# EAGLE design RMCB4 (EAGLE 9.5.2)
COMPANY: ADAFRUIT INDUSTRIES; DRAWN: KTOWN; REV: B
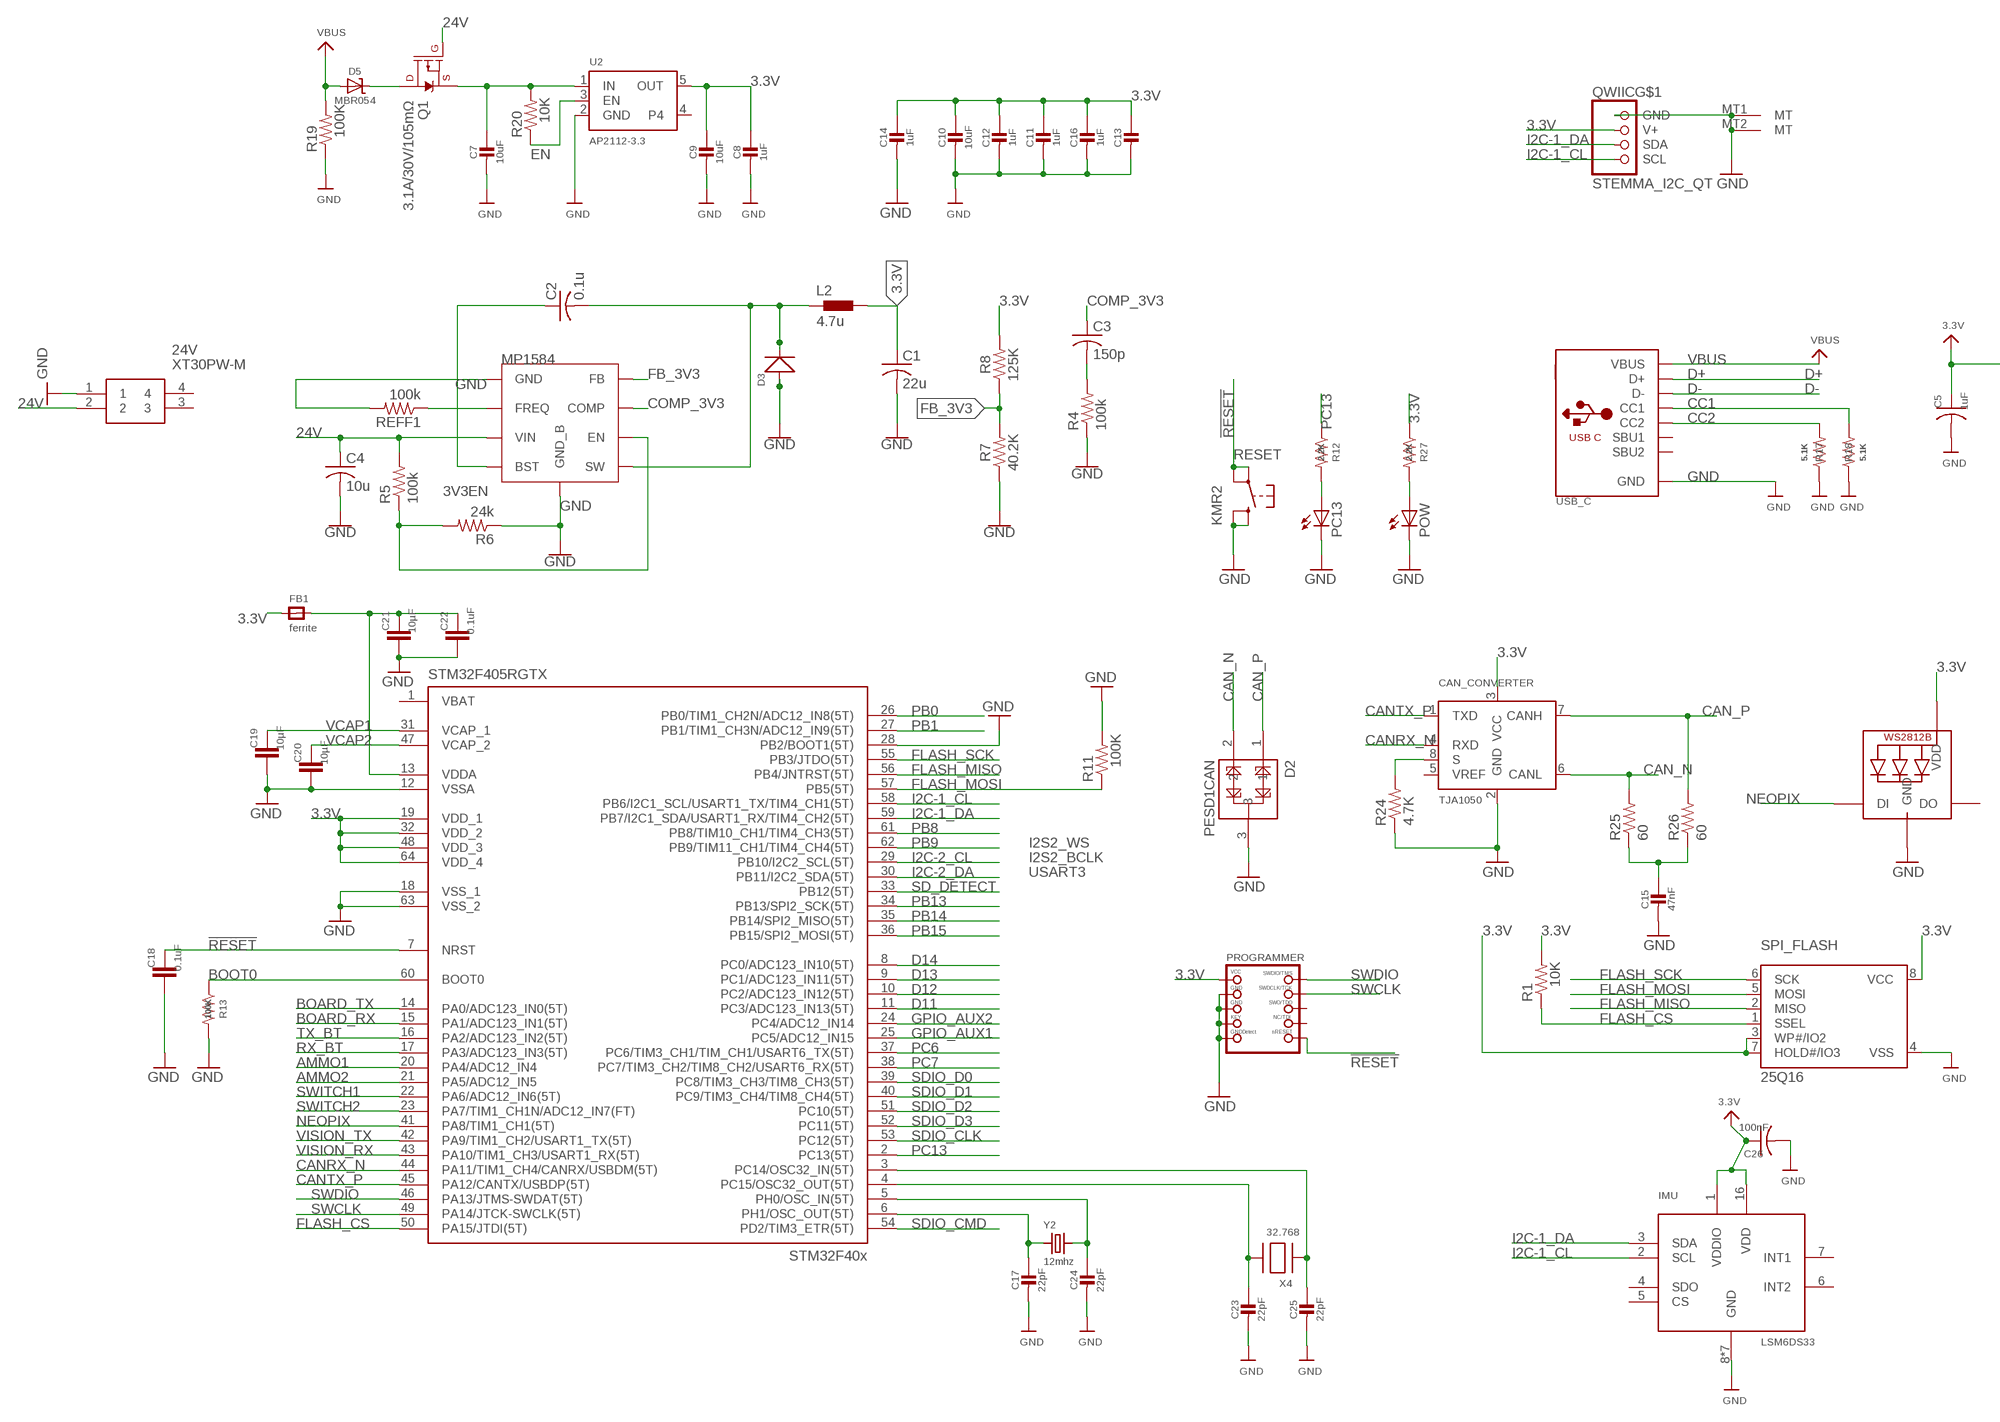
[diagram p0: schematic, sheet 1, part 1 of 2]
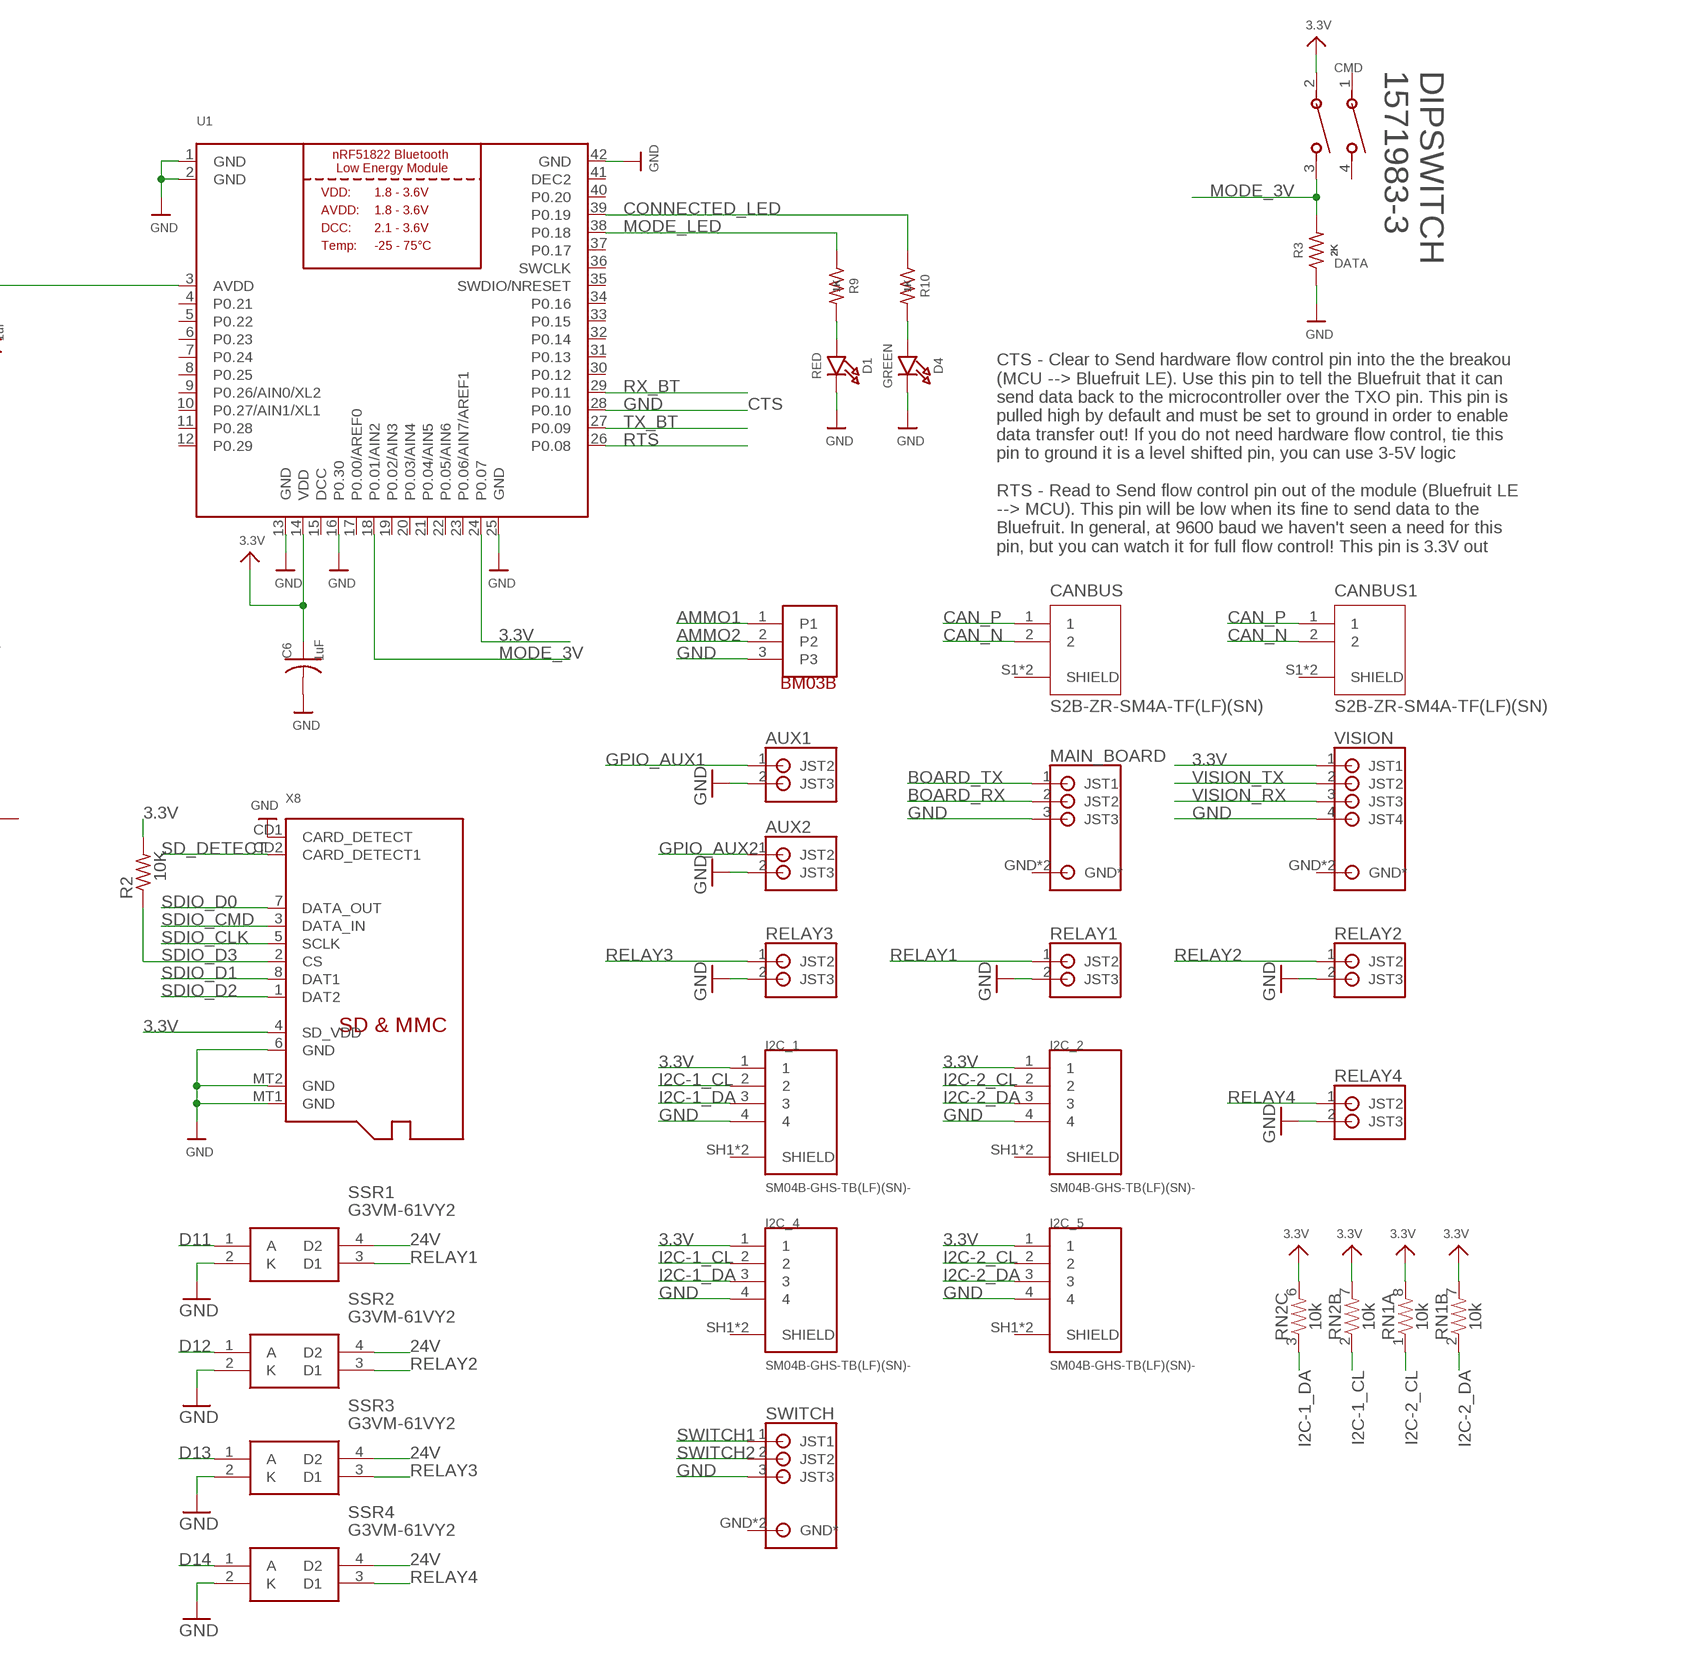
[diagram p1: schematic, sheet 1, part 2 of 2]

## Parts
24V  XT30PW-M  [XT30PWM]
AMMO_DETEC  BM03-GHS_TBT  [BM03-GHS-TBT]
AUX1  S2B-PH-SM4_TB  [S2B-PH-SM4_TB]
AUX2  S2B-PH-SM4_TB  [S2B-PH-SM4_TB]
C1  22u  C-USC1206  [C1206]
C2  0.1u  C-USC0603  [C0603]
C3  150p  C-USC0603  [C0603]
C4  10u  C-USC1206  [C1206]
C5  1uF  C-USC0603  [C0603]
C6  1uF  C-USC0603  [C0603]
C7  10uF  CAP_CERAMIC0603_NO  [0603-NO]
C8  1uF  CAP_CERAMIC0603_NO  [0603-NO]
C9  10uF  CAP_CERAMIC0603_NO  [0603-NO]
C10  10uF  CAP_CERAMIC0603_NO  [0603-NO]
C11  1uF  CAP_CERAMIC0603_NO  [0603-NO]
C12  1uF  CAP_CERAMIC0603_NO  [0603-NO]
C13  1uF  CAP_CERAMIC0603_NO  [0603-NO]
C14  1uF  CAP_CERAMIC0603_NO  [0603-NO]
C15  47nF  CAP_CERAMIC0603_NO  [0603-NO]
C16  1uF  CAP_CERAMIC0603_NO  [0603-NO]
C17  22pF  CAP_CERAMIC0603_NO  [0603-NO]
C18  0.1uF  C-EUC0603  [C0603]
C19  10µF  C-EUC0603  [C0603]
C20  10µF  C-EUC0603  [C0603]
C21  10µF  C-EUC0603  [C0603]
C22  0.1uF  C-EUC0603  [C0603]
C23  22pF  CAP_CERAMIC0603_NO  [0603-NO]
C24  22pF  CAP_CERAMIC0603_NO  [0603-NO]
C25  22pF  CAP_CERAMIC0603_NO  [0603-NO]
C26  100nF  C-USC0603  [C0603]
CAN_CONVERTER  TJA1050  [SOT96-1]
CANBUS  S2B-ZR-SM4A-TF(LF)(SN)  [JST_S2B-ZR-SM4A-TF(LF)(SN)]
CANBUS1  S2B-ZR-SM4A-TF(LF)(SN)  [JST_S2B-ZR-SM4A-TF(LF)(SN)]
D1  RED  LED0805_NOOUTLINE  [CHIPLED_0805_NOOUTLINE]
D2  PESD1CAN  [SOT23-3]
D3  SMD-DIODE-SCHOTTKY-40V-3A(DO-214AB)  [DO-214AB]
D4  GREEN  LED0805_NOOUTLINE  [CHIPLED_0805_NOOUTLINE]
D5  MBR054  DIODE-SCHOTTKYSOD-123  [SOD-123]
DIPSWITCH  1571983-3  [SWSO4_300X100P50B]
FB1  ferrite  FERRITE-0805NO  [0805-NO@1]
I2C_1  SM04B-GHS-TB(LF)(SN)-  [JST_SM04B-GHS-TB(LF)(SN)-]
I2C_2  SM04B-GHS-TB(LF)(SN)-  [JST_SM04B-GHS-TB(LF)(SN)-]
I2C_4  SM04B-GHS-TB(LF)(SN)-  [JST_SM04B-GHS-TB(LF)(SN)-]
I2C_5  SM04B-GHS-TB(LF)(SN)-  [JST_SM04B-GHS-TB(LF)(SN)-]
IMU  LSM6DS33  [LGA16_3X3MM]
L2  4.7u  MHCI0603-4R7M-R8  [MHCI0603-4R7M-R8]
MAIN_BOARD  S3B-PH-SM4_TB  [S3B-PH-SM4_TB]
NEO  WS2812B3535  [LED3535]
PC13  LEDCHIPLED_0603  [CHIPLED_0603]
POW  LEDCHIPLED_0603  [CHIPLED_0603]
PROGRAMMER  JTAG-CORTEX  [2X05_1.27MM_SMT]
Q1  3.1A/30V/105mΩ  MOSFET_PCH-DMG2307L  [SOT23-3]
QWIIC  STEMMA_I2C_QT  [JST_SH4]
R1  10K  R-US_R0603  [R0603]
R2  10K  R-US_R0603  [R0603]
R3  2K  R-US_R0603  [R0603]
R4  100k  R-US_R0603  [R0603]
R5  100k  R-US_R0603  [R0603]
R6  24k  R-US_R0603  [R0603]
R7  40.2K  220KOHM-0603-1/10W-1%  [0603]
R8  125K  RESISTOR0603  [0603]
R9  1K  R-US_R0603  [R0603]
R10  1K  R-US_R0603  [R0603]
R11  100K  R-US_R0603  [R0603]
R12  2.2K  R-US_R0603  [R0603]
R13  100K  R-US_R0603  [R0603]
R17  5.1K  R-US_R0603  [R0603]
R18  5.1K  R-US_R0603  [R0603]
R19  100K  R-US_R0603  [R0603]
R20  10K  R-US_R0603  [R0603]
R24  4.7K  R-US_R0603  [R0603]
R25  60  R-US_R0603  [R0603]
R26  60  R-US_R0603  [R0603]
R27  2.2K  R-US_R0603  [R0603]
REFF1  100k  R-US_R0603  [R0603]
RELAY1  S2B-PH-SM4_TB  [S2B-PH-SM4_TB]
RELAY2  S2B-PH-SM4_TB  [S2B-PH-SM4_TB]
RELAY3  S2B-PH-SM4_TB  [S2B-PH-SM4_TB]
RELAY4  S2B-PH-SM4_TB  [S2B-PH-SM4_TB]
RESET  KMR2  SWITCH_TACT_SMT4.6X2.8  [BTN_KMR2_4.6X2.8]
RN1  10k  1KOHM-ARRAY(4)-0805_ARV-1/10W-5%  [0805-ARV]
RN2  10k  1KOHM-ARRAY(4)-0805_ARV-1/10W-5%  [0805-ARV]
SPI_FLASH  25Q16  SPIFLASH_8PIN  [SOIC8_150MIL]
SSR1  G3VM-61VY2  [SOP254P700X230-4N]
SSR2  G3VM-61VY2  [SOP254P700X230-4N]
SSR3  G3VM-61VY2  [SOP254P700X230-4N]
SSR4  G3VM-61VY2  [SOP254P700X230-4N]
STM32F405RGTX  STM32F405R  [TQFP64]
SWITCH  S3B-PH-SM4_TB  [S3B-PH-SM4_TB]
U1  NRF51822_MODULE_MDBT40  [BLE_MODULE_RAYTAC_MDBT40]
U2  AP2112-3.3  VREG_SOT23-5  [SOT23-5]
U$10  MP1584_V2  [MP1584_V2]
USB_C  USB_C  [USB_C_CUSB31-CFM2AX-01-X]
VISION  S4B-PH-SM4_TB  [S4B-PH-SM4_TB]
X4  32.768  XTAL-3.2X1.5  [XTAL3215]
X8  MICROSD  [MICROSD]
Y2  12mhz  CRYSTAL2.5X2.0  [CRYSTAL_2.5X2]

## Nets
3.3V: C1.1 C5.1 C6.1 C8.1 C9.1 C10.1 C11.1 C12.1 C13.1 C14.1 C16.1 C26.1 CAN_CONVERTER.3(VCC) DIPSWITCH.2 FB1.1 I2C_1.1 I2C_2.1 I2C_4.1 I2C_5.1 IMU.1(VDDIO) IMU.16(VDD) L2.P$2 NEO.2(VDD) PROGRAMMER.1(VCC) QWIIC.2(V+) R1.2 R2.2 R8.2 R27.1 RN1.7 RN1.8 RN2.6 RN2.7 SPI_FLASH.3(WP#/IO2) SPI_FLASH.7(HOLD#/IO3) SPI_FLASH.8(VCC) STM32F405RGTX.19(VDD_1) STM32F405RGTX.32(VDD_2) STM32F405RGTX.48(VDD_3) STM32F405RGTX.64(VDD_4) U1.3(AVDD) U1.14(VDD) U1.24(P0.07) U2.5(OUT) VISION.1(JST1) X8.4(SD_VDD)
3V3EN: R5.1 R6.2 U$10.EN
24V [power]: 24V.2 C4.1 Q1.1(G) R5.2 SSR1.4(D2) SSR2.4(D2) SSR3.4(D2) SSR4.4(D2) U$10.VIN
!RESET: C18.1 PROGRAMMER.10(NRESET) RESET.A'(P1) RESET.A(P) STM32F405RGTX.7(NRST)
AMMO1: AMMO_DETEC.1 STM32F405RGTX.20(PA4/ADC12_IN4)
AMMO2: AMMO_DETEC.2 STM32F405RGTX.21(PA5/ADC12_IN5)
BOARD_RX: MAIN_BOARD.2(JST2) STM32F405RGTX.15(PA1/ADC123_IN1(5T))
BOARD_TX: MAIN_BOARD.1(JST1) STM32F405RGTX.14(PA0/ADC123_IN0(5T))
BOOT0: R13.1 STM32F405RGTX.60(BOOT0)
BST1: C2.1 U$10.BST
CAN_N: CAN_CONVERTER.6(CANL) CANBUS1.2 CANBUS.2 D2.2 R25.2
CAN_P: CAN_CONVERTER.7(CANH) CANBUS1.1 CANBUS.1 D2.1 R26.2
CANRX_N: CAN_CONVERTER.4(RXD) STM32F405RGTX.44(PA11/TIM1_CH4/CANRX/USBDM(5T))
CANTX_P: CAN_CONVERTER.1(TXD) STM32F405RGTX.45(PA12/CANTX/USBDP(5T))
CC1: R18.2 USB_C.A5(CC1)
CC2: R17.2 USB_C.B5(CC2)
COMP_3V3: C3.1 U$10.COMP
CONNECTED_LED: R10.1 U1.39(P0.19)
D11: SSR1.1(A) STM32F405RGTX.11(PC3/ADC123_IN13(5T))
D12: SSR2.1(A) STM32F405RGTX.10(PC2/ADC123_IN12(5T))
D13: SSR3.1(A) STM32F405RGTX.9(PC1/ADC123_IN11(5T))
D14: SSR4.1(A) STM32F405RGTX.8(PC0/ADC123_IN10(5T))
D+: USB_C.A6(D+) USB_C.B6(D+)
D-: USB_C.A7(D-) USB_C.B7(D-)
EN: R20.1 U2.3(EN)
FB_3V3: R7.2 R8.1 U$10.FB
FLASH_CS: R1.1 SPI_FLASH.1(SSEL) STM32F405RGTX.50(PA15/JTDI(5T))
FLASH_MISO: SPI_FLASH.2(MISO) STM32F405RGTX.56(PB4/JNTRST(5T))
FLASH_MOSI: R11.1 SPI_FLASH.5(MOSI) STM32F405RGTX.57(PB5(5T))
FLASH_SCK: SPI_FLASH.6(SCK) STM32F405RGTX.55(PB3/JTDO(5T))
FREQ1: REFF1.1 U$10.FREQ
GND [gnd]: 24V.1 AMMO_DETEC.3 AUX1.2(JST3) AUX2.2(JST3) C1.2 C4.2 C5.2 C6.2 C7.2 C8.2 C9.2 C10.2 C11.2 C12.2 C13.2 C14.2 C15.2 C16.2 C17.2 C18.2 C19.2 C20.2 C21.2 C22.2 C23.2 C24.2 C25.2 C26.2 CAN_CONVERTER.2(GND) D1.C D2.3 D3.1(+) D4.C I2C_1.4 I2C_2.4 I2C_4.4 I2C_5.4 IMU.8(GND) IMU.9(GND) IMU.10(GND) IMU.11(GND) IMU.12(GND) IMU.13(GND) IMU.15(GND) MAIN_BOARD.3(JST3) NEO.4(GND) PC13.C POW.C PROGRAMMER.3(GND) PROGRAMMER.5(GND) PROGRAMMER.7(KEY) PROGRAMMER.9(GNDDETECT) QWIIC.1(GND) QWIIC.MT1(MT) QWIIC.MT2(MT) R3.1 R4.1 R6.1 R7.1 R11.2 R13.2 R17.1 R18.1 R19.1 R24.1 REFF1.2 RELAY1.2(JST3) RELAY2.2(JST3) RELAY3.2(JST3) RELAY4.2(JST3) RESET.B'(S1) RESET.B(S) SPI_FLASH.4(VSS) SSR1.2(K) SSR2.2(K) SSR3.2(K) SSR4.2(K) STM32F405RGTX.12(VSSA) STM32F405RGTX.18(VSS_1) STM32F405RGTX.28(PB2/BOOT1(5T)) STM32F405RGTX.63(VSS_2) SWITCH.3(JST3) U1.1(GND) U1.2(GND) U1.13(GND) U1.16(P0.30) U1.25(GND) U1.28(P0.10) U1.42(GND) U2.2(GND) U$10.GND U$10.GND_B USB_C.A1B12(GND) USB_C.B1A12(GND) VISION.4(JST4) X8.6(GND) X8.CD1(CARD_DETECT) X8.MT1(GND) X8.MT2(GND)
GPIO_AUX1: AUX1.1(JST2) STM32F405RGTX.25(PC5/ADC12_IN15)
GPIO_AUX2: AUX2.1(JST2) STM32F405RGTX.24(PC4/ADC12_IN14)
I2C-1_CL: I2C_1.2 I2C_4.2 IMU.2(SCL) QWIIC.4(SCL) RN2.2 STM32F405RGTX.58(PB6/I2C1_SCL/USART1_TX/TIM4_CH1(5T))
I2C-1_DA: I2C_1.3 I2C_4.3 IMU.3(SDA) QWIIC.3(SDA) RN2.3 STM32F405RGTX.59(PB7/I2C1_SDA/USART1_RX/TIM4_CH2(5T))
I2C-2_CL: I2C_2.2 I2C_5.2 RN1.1 STM32F405RGTX.29(PB10/I2C2_SCL(5T))
I2C-2_DA: I2C_2.3 I2C_5.3 RN1.2 STM32F405RGTX.30(PB11/I2C2_SDA(5T))
MODE_3V: DIPSWITCH.3 R3.2 U1.18(P0.01/AIN2)
MODE_LED: R9.1 U1.38(P0.18)
N$3: C3.2 R4.2
N$5: D1.A R9.2
N$6: D4.A R10.2
N$9: C25.1 STM32F405RGTX.3(PC14/OSC32_IN(5T)) X4.P$1
N$10: C23.1 STM32F405RGTX.4(PC15/OSC32_OUT(5T)) X4.P$2
N$11: C24.1 STM32F405RGTX.5(PH0/OSC_IN(5T)) Y2.3
N$12: C17.1 STM32F405RGTX.6(PH1/OSC_OUT(5T)) Y2.1
N$13: PC13.A R12.2
N$20: C21.1 C22.1 FB1.2 STM32F405RGTX.13(VDDA)
N$21: CAN_CONVERTER.8(S) R24.2
N$22: C15.1 R25.1 R26.1
N$23: POW.A R27.2
N$32: D5.C Q1.3(D)
NEOPIX: NEO.1(DI) STM32F405RGTX.41(PA8/TIM1_CH1(5T))
PB0: STM32F405RGTX.26(PB0/TIM1_CH2N/ADC12_IN8(5T))
PB1: STM32F405RGTX.27(PB1/TIM1_CH3N/ADC12_IN9(5T))
PB8: STM32F405RGTX.61(PB8/TIM10_CH1/TIM4_CH3(5T))
PB9: STM32F405RGTX.62(PB9/TIM11_CH1/TIM4_CH4(5T))
PB13: STM32F405RGTX.34(PB13/SPI2_SCK(5T))
PB14: STM32F405RGTX.35(PB14/SPI2_MISO(5T))
PB15: STM32F405RGTX.36(PB15/SPI2_MOSI(5T))
PC6: STM32F405RGTX.37(PC6/TIM3_CH1/TIM_CH1/USART6_TX(5T))
PC7: STM32F405RGTX.38(PC7/TIM3_CH2/TIM8_CH2/USART6_RX(5T))
PC13: R12.1 STM32F405RGTX.2(PC13(5T))
RELAY1: RELAY1.1(JST2) SSR1.3(D1)
RELAY2: RELAY2.1(JST2) SSR2.3(D1)
RELAY3: RELAY3.1(JST2) SSR3.3(D1)
RELAY4: RELAY4.1(JST2) SSR4.3(D1)
RTS: U1.26(P0.08)
RX_BT: STM32F405RGTX.17(PA3/ADC123_IN3(5T)) U1.29(P0.11)
SD_DETECT: STM32F405RGTX.33(PB12(5T)) X8.CD2(CARD_DETECT1)
SDIO_CLK: STM32F405RGTX.53(PC12(5T)) X8.5(SCLK)
SDIO_CMD: STM32F405RGTX.54(PD2/TIM3_ETR(5T)) X8.3(DATA_IN)
SDIO_D0: STM32F405RGTX.39(PC8/TIM3_CH3/TIM8_CH3(5T)) X8.7(DATA_OUT)
SDIO_D1: STM32F405RGTX.40(PC9/TIM3_CH4/TIM8_CH4(5T)) X8.8(DAT1)
SDIO_D2: STM32F405RGTX.51(PC10(5T)) X8.1(DAT2)
SDIO_D3: R2.1 STM32F405RGTX.52(PC11(5T)) X8.2(CS)
SW1: C2.2 D3.2(-) L2.P$1 U$10.SW
SWCLK: PROGRAMMER.4(SWDCLK) STM32F405RGTX.49(PA14/JTCK-SWCLK(5T))
SWDIO: PROGRAMMER.2(SWDIO) STM32F405RGTX.46(PA13/JTMS-SWDAT(5T))
SWITCH1: STM32F405RGTX.22(PA6/ADC12_IN6(5T)) SWITCH.1(JST1)
SWITCH2: STM32F405RGTX.23(PA7/TIM1_CH1N/ADC12_IN7(FT)) SWITCH.2(JST2)
TX_BT: STM32F405RGTX.16(PA2/ADC123_IN2(5T)) U1.27(P0.09)
VBUS [power]: D5.A R19.2 USB_C.A4B9(VBUS) USB_C.B4A9(VBUS)
VCAP1: C19.1 STM32F405RGTX.31(VCAP_1)
VCAP2: C20.1 STM32F405RGTX.47(VCAP_2)
VHI: C7.1 Q1.2(S) R20.2 U2.1(IN)
VISION_RX: STM32F405RGTX.43(PA10/TIM1_CH3/USART1_RX(5T)) VISION.3(JST3)
VISION_TX: STM32F405RGTX.42(PA9/TIM1_CH2/USART1_TX(5T)) VISION.2(JST2)
Unconnected: 24V.3 24V.4 CAN_CONVERTER.5(VREF) CANBUS1.S1(SHIELD) CANBUS1.S2(SHIELD) CANBUS.S1(SHIELD) CANBUS.S2(SHIELD) DIPSWITCH.1 DIPSWITCH.4 IMU.4(SDO) IMU.5(CS) IMU.6(INT2) IMU.7(INT1) MAIN_BOARD.GND2(GND*) MAIN_BOARD.GND(GND*) NEO.3(DO) PROGRAMMER.6(SWO) PROGRAMMER.8(TDI) RN1.3 RN1.4 RN1.5 RN1.6 RN2.1 RN2.4 RN2.5 RN2.8 STM32F405RGTX.1(VBAT) SWITCH.GND2(GND*) SWITCH.GND(GND*) U1.4(P0.21) U1.5(P0.22) U1.6(P0.23) U1.7(P0.24) U1.8(P0.25) U1.9(P0.26/AIN0/XL2) U1.10(P0.27/AIN1/XL1) U1.11(P0.28) U1.12(P0.29) U1.17(P0.00/AREF0) U1.19(P0.02/AIN3) U1.20(P0.03/AIN4) U1.21(P0.04/AIN5) U1.22(P0.05/AIN6) U1.23(P0.06/AIN7/AREF1) U1.30(P0.12) U1.31(P0.13) U1.32(P0.14) U1.33(P0.15) U1.34(P0.16) U1.35(SWDIO/NRESET) U1.36(SWCLK) U1.37(P0.17) U1.40(P0.20) U2.4 USB_C.A8(SBU1) USB_C.B8(SBU2) VISION.GND2(GND*) VISION.GND(GND*)

## Notes on the sheet
- CMD
- DATA
- CTS
- CTS - Clear to Send hardware flow control pin into the the breakou 
  (MCU --> Bluefruit LE). Use this pin to tell the Bluefruit that it can 
  send data back to the microcontroller over the TXO pin. This pin is 
  pulled high by default and must be set to ground in order to enable 
  data transfer out! If you do not need hardware flow control, tie this 
  pin to ground it is a level shifted pin, you can use 3-5V logic
  
  RTS - Read to Send flow control pin out of the module (Bluefruit LE 
  --> MCU). This pin will be low when its fine to send data to the 
  Bluefruit. In general, at 9600 baud we haven't seen a need for this 
  pin, but you can watch it for full flow control! This pin is 3.3V out
- I2S2_WS
- I2S2_BCLK
- USART3

## Power pins joined to a net without a drawn wire
DCC: U1.15(DCC)
DEC2: U1.41(DEC2)
SHIELD: I2C_1.SH1(SHIELD) I2C_1.SH2(SHIELD) I2C_2.SH1(SHIELD) I2C_2.SH2(SHIELD) I2C_4.SH1(SHIELD) I2C_4.SH2(SHIELD) I2C_5.SH1(SHIELD) I2C_5.SH2(SHIELD)

## Library data of the parts
24V = SamacSys_Parts:XT30PW-M: 30A Low Temperature Rise Fire Retardant Plug Source: Datasheet <https://www.tme.eu/sl/Document/ce4077e36b79046da520ca73227e15de/XT30PW SPEC.pdf>; DESCRIPTION: 30A Low Temperature Rise Fire Retardant Plug; HEIGHT: 5mm; MANUFACTURER_NAME: Amass; MANUFACTURER_PART_NUMBER: XT30PW-M
AMMO_DETEC = SamacSys_Parts:BM03-GHS_TBT
AUX1 AUX2 RELAY1-RELAY4 = KevinMade:S2B-PH-SM4_TB
C1-C4 = adafruit:C-US: CAPACITOR, American symbol
C5 C6 C26 = rcl:C-US: CAPACITOR, American symbol; SPICEPREFIX: C
C7-C17 C23-C25 = microbuilder:CAP_CERAMIC: Ceramic Capacitors For new designs, use the packages preceded by an '_' character since they are more reliable: The following footprints should be used on most boards: _0402 - Standard footprint for regular board layouts _0603 - Standard footprint for regular board layouts _0805 - Standard footprint for regular board layouts _1206 - Standard footprint for regular board layouts For extremely tight-pitch boards where space is at a premium, the following 'micro-pitch' footprints can be used (smaller pads, no silkscreen outline, etc.): _0402MP - Micro-pitch footprint for very dense/compact boards _0603MP - Micro-pitch footprint for very dense/compact boards _0805MP - Micro-pitch footprint for very dense/compact boards _1206MP - Micro-pitch footprint for very dense/compact boards
C18-C22 = rcl:C-EU: CAPACITOR, European symbol; SPICEPREFIX: C
CAN_CONVERTER = TJA1050:TJA1050: High speed CAN transceiver The TJA1050 is the interface between the Controller Area Network (CAN) protocol controller and the physical bus. The device provides differential transmit capability to the bus and differential receive capability to the CAN controller. The TJA1050 is the third Philips high-speed CAN transceiver after the PCA82C250 and the PCA82C251. The most important differences are: Much lower electromagnetic emission due to optimal matching of the output signals CANH and CANL Improved behaviour in case of an unpowered node No standby mode. This makes the TJA1050 eminently suitable for use in nodes that are in a power-down situation in partially powered networks. AAL Eindhoven MK; AVAILABILITY: Unavailable; DESCRIPTION: 1/1 Transceiver Half CANbus 8-SO; MF: NXP USA; MP: TJA1050; PACKAGE: SOIC-8 NXP USA; PRICE: None
CANBUS CANBUS1 = S2B-ZR-SM4A-TF_LF__SN_:S2B-ZR-SM4A-TF(LF)(SN): ZH Series 2 Position 1.5 mm Pitch Surface Mount Side Entry Shrouded Header; AVAILABILITY: Unavailable; DESCRIPTION: Connector Header Surface Mount, Right Angle 2 position 0.059 _1.50mm_; MF: JST Sales; MP: S2B-ZR-SM4A-TF_LF__SN_; PACKAGE: None; PRICE: None
D1 D4 = microbuilder:LED: LED
D2 = PESD1CAN:PESD1CAN: PESD1CAN is used to protect two automotive CAN bus lines from ESD.; AVAILABILITY: Unavailable; DESCRIPTION: 50V Clamp 3A _8/20µs_ Ipp Tvs Diode Surface Mount SC-70; MF: NXP Semiconductors; MP: PESD1CAN; PACKAGE: SC-70 NXP Semiconductors; PRICE: None
D3 = SMD-DIODE-SCHOTTKY-40V-3A_DO-214AB_:SMD-DIODE-SCHOTTKY-40V-3A(DO-214AB): 304020018; AVAILABILITY: Unavailable; DESCRIPTION: Rectifier, Schottky; DO-214AB; 3.0A IF; 0.75V; 40V; 100A IFRM; 10000V/us; 1000pF; MF: Vishay; MP: SS34-E3/57T; PACKAGE: DO-214 Vishay; PRICE: None
D5 = microbuilder:DIODE-SCHOTTKY
DIPSWITCH = Switches:1571983-3; BUILT_BY: EMA_UL_Team; CATEGORY: DIP & SIP Switches; COPYRIGHT: Copyright (C) 2016 Accelerated Designs. All rights reserved; DESCRIPTION: GDH02STR04=DIP SWITCH; MANUFACTURER_PART_NUMBER: 1571983-3; PART_STATUS: active; SERIES: Alcoswitch DIP,Alcoswitch DIP GDH; VENDOR: TE Connectivity
FB1 = microbuilder:FERRITE: Ferrite Bead 0603 MMZ1608B121C - 120 Ohm @ 100MHz, 600mA, 0.15 Ohm DC Resistance - Digikey: 445-2164-1-ND BK1608HW121-T - 120 Ohm, 600mA Ferrite Chip - Digikey: 587-1876-2-ND 0805 HZ0805B272R-10 - 2.7K Ohm @ 100MHz, 200mA, 0.8 Ohm DC Resistance - Digikey: 240-2504-1-ND (see also Murata BLM21BD272SN1L) MMZ2012Y152B - 1.5K Ohm @ 100MHz, 500mA, 0.4 Ohm DC Resistance - Digikey: 445-1560-1-ND - Mainly for high frequency (80-400MHz) MMZ2012R102A - 1K Ohm @ 100MHz, 500mA, 0.3 Ohm DC Resistance - Digikey: 445-1555-2-ND - More general purpose (10-200MHz)
I2C_1 I2C_2 I2C_4 I2C_5 = SM04B-GHS-TB_LF__SN_-:SM04B-GHS-TB(LF)(SN)-: Conn Header Gh Side 4pos 1.25mm; AVAILABILITY: Unavailable; DESCRIPTION: Connector Header Surface Mount, Right Angle 4 position 0.049 _1.25mm_; MF: JST Sales; MP: SM04B-GHS-TB_LF__SN_-; PACKAGE: None; PRICE: None
IMU = adafruit_sensor:LSM6DS33
L2 = NewKevinMade:MHCI0603-4R7M-R8
MAIN_BOARD SWITCH = KevinMade:S3B-PH-SM4_TB
NEO = microbuilder:WS2812B
PC13 POW = adafruit:LED: LED
PROGRAMMER = microbuilder:JTAG-CORTEX: Serial Wire (SW-DP) Connector Standard 0.05" 10-pin connector is for use with the Cortex M and Cortex A SWD (serial wire debugger) interface (SW-DP) Connectors 2x05_1.27MM_SMT - Inexpensive surface-mount header with bare pins, compatible with standard 10-pin SWD cables (4UCON: 16846) 2x05_1.27MM_BOX_NOPOSTS - Polarised surface-mount box (4UCON with caps: 19735, without caps: 15117 2x05_1.27MM_BOX_POSTS - Polarised surface-mount box with mounting holes (4UCON: 20317) Pinout: http://infocenter.arm.com/help/topic/com.arm.doc.faqs/attached/13634/cortex_debug_connectors.pdf http://www.keil.com/peripherals/coresight/connectors.asp
Q1 = SparkFun-DiscreteSemi:MOSFET_PCH: P-channel MOSFETs Voltage controlled devices that allow control of high current outputs. SparkFun Products: SparkFun ESP32 Thing <https://www.sparkfun.com/products/13907> SparkFun ESP8266 Thing <https://www.sparkfun.com/products/13231> SparkFun Pi Servo HAT V2 <https://www.sparkfun.com/products/15316> DMG2305UX-7 (20V/4.2A/SOT23-3); PROD_ID: TRANS-11308
QWIIC = microbuilder:STEMMA_I2C
R1-R3 R9-R13 R17-R20 R27 = rcl:R-US_: RESISTOR, American symbol; SPICEPREFIX: R
R4-R6 R24-R26 REFF1 = adafruit:R-US_: RESISTOR, American symbol
R7 = SparkFun-Resistors:220KOHM: 220kΩ resistor A resistor is a passive two-terminal electrical component that implements electrical resistance as a circuit element. Resistors act to reduce current flow, and, at the same time, act to lower voltage levels within circuits. - Wikipedia; PROD_ID: RES-08969; VALUE: 220k
R8 = SparkFun-Resistors:RESISTOR: Generic Resistor Package
RESET = microbuilder:SWITCH_TACT_SMT: SMT Tact Switches 6x6mm - Digikey: P12940SCT-ND KMR2 (4.6x2.8mm) - Digikey: 401-1426-1-ND EVQ-PQHB55 - Light Touch, 160GF (4.5x4.5mm) - Digikey: P8090SCT-ND KMT0 - KMT021 NGJ LHS (etc.) IP68/Waterproof - Digikey: CKN10289CT-ND
RN1 RN2 = SparkFun-Resistors:1KOHM-ARRAY(4): 4 x 1kΩ resistor array A resistor is a passive two-terminal electrical component that implements electrical resistance as a circuit element. Resistors act to reduce current flow, and, at the same time, act to lower voltage levels within circuits. - Wikipedia An array is a collection of discrete resistors in a single package.; PROD_ID: RES-13020; VALUE: 1k
SPI_FLASH = microbuilder:SPIFLASH_8PIN: SOIC8 SPI Flash Be careful with the size since SOIC8 flash comes in several 'widths' SOIC8 150 mil M25P16 - 16Mbit (2Mbit x 8) Serial Flash (75MHz SPI Bus), Supply: 2.7-3.6V Digikey: SOIC8 - M25P16-VMN6P-ND SOIC8 208 mil W25Q16BVSSIG - 16Mbit (2Mbit x 8) Serial Flash (104MHz SPI Bus), Supply: 2.7-3.6V Digikey: SOIC8 - W25Q16BVSSIG-ND
SSR1-SSR4 = SamacSys_Parts:G3VM-61VY2: Solid State Relays - PCB Mount Mos Fet Relay, SMT 60V, 1 form A,SOP4 Source: Datasheet <https://componentsearchengine.com/Datasheets/1/G3VM-61VY2.pdf>; DESCRIPTION: Solid State Relays - PCB Mount Mos Fet Relay, SMT 60V, 1 form A,SOP4; HEIGHT: 2.3mm; MANUFACTURER_NAME: Omron Electronics; MANUFACTURER_PART_NUMBER: G3VM-61VY2; MOUSER_PART_NUMBER: 653-G3VM61VY2; MOUSER_PRICE-STOCK: https://www.mouser.com/Search/Refine.aspx?Keyword=653-G3VM61VY2
STM32F405RGTX = adafruit_micro:STM32F405R: STM32F405 64 pin LQFP reviewed: YES tested: YES
U1 = microbuilder:NRF51822_MODULE_MDBT40: nRF51822 Bluetooth Low Energy Module
U2 = microbuilder:VREG_SOT23-5: SOT23-5 Fixed Voltage Regulators Part Current Out V Out V In V Dropout θJA (°C/W) TJ (°C) Digikey Part No. ADP121 150mA 3.3V 3.4-5.5V 0.09V @ 150mA -- -- ADP121-AUJZ33R7CT-ND ADP121 150mA 3.0V 3.1-5.5V 0.09V @ 150mA -- -- ADP121-AUJZ30R7CT-ND ADP122 300mA 3.3V 3.4-5.5V 0.085V @ 300mA -- -- ADP122AUJZ-3.3-R7CT-ND ADP1712 300mA 3.3V 3.5-5.5V 0.17V @ 300mA -- -- ADP1712AUJZ-3.3-R7TR-ND AP7311 (Low Cost) 150mA 3.3V 3.5-6V 0.15V @ 150mA -- -- AP7311-33WG-7DICT-ND LD39015M18R 150mA 1.8V 1.9V-5.5V 0.08V @ 100mA -- -- 497-6977-1-ND LP2985A-33DBVR 150mA 3.3V 3.3-16V 0.28V @ 150mA 206 150 296-18479-1-ND MCP1824T-3302E/OT 300mA 3.3V 3.5V-6V 0.2V @ 300mA -- -- MCP1824T-3302E/OTCT-ND MIC5205-2.5YM5 TR 150mA 2.5V 2.7-16V 0.165V @ 150mA -- -- 576-1257-2-ND MIC5205-3.0YM5 TR 150mA 3.0V 3.2V-16V 0.165V @ 150mA -- -- 576-1258-2-ND MIC5205-3.3YM5 TR 150mA 3.3V 3.5V-16V 0.165V @ 150mA -- -- 576-1259-2-ND TPS780330220 150mA 3.3V+2.2V 3.6-5.5V 250mV Max -- -- 296-23332-1-ND TDA3663/N1,135 100mA 3.3V 3.5-45V 0.18V @ 50mA -- -- 568-5343-1-ND Max operating temp can be calculated using θJA, TJ (max junction temperature), and power in watts. Set the "Maximum Ambient Temperature" until it reaches TJ ("Max Junction Temperature"), which is the absolute limit for safe use of the regulator: Heat Sink Temperature Calculator <http://www.daycounter.com/Calculators/Heat-Sink-Temperature-Calculator.phtml> For example, With 12V source into a 3.3V LP2985 and a 30mA load, we are dissipating (12V-3.3V) * 0.03A = 0.261W. With a θJA of 206 °C/W, a TJ of 150°C, and 261mW we can safely use the chip without a heat sink up to 75°C (=147.1°C Junction Temperature).
U$10 = mp1584S:MP1584_V2
USB_C = microbuilder:USB_C: USB Type-C USB 2.0 Connector
VISION = KevinMade:S4B-PH-SM4_TB
X4 = adafruit2:XTAL: Low cost SMT crystals, no capacitors included http://www.ladyada.net/library/eagle
X8 = microbuilder:MICROSD: MicroSD/Transflash Card Holder with SPI pinout 3M: 2908-05WB-MG 4UConnector: 19656 Footprint courtesy: Adafruit Industries
Y2 = microbuilder:CRYSTAL: Crystals HC49UP - Surface Mount Crystal 4.0MHz 18pF +/-30ppm Surface Mount Crystal [Digikey: 535-9857-1-ND] 12.0 MHz Surface Mount Crystal [Digikey: 535-9869-6-ND] 25.0 MHz Surface Mount Crystal [Digikey: 535-9078-1-ND] 2.5 x 2.0mm - MEMs SMT Crystal 16.0 MHz 10pF 20ppm 2.5 x 2.0mm Crystal [Digikey -40-85°C: 535-10923-1-ND] 3.2 x 2.5mm - MEMs SMT Crystal 12.0 MHz 8pF 15ppm 3.2 x 2.5mm Crystal [Digikey: -10-70°C: 644-1047-1-ND -40-125°C: 644-1128-1-ND] 40~85°C cheaper: 644-1173-6-ND 16.0 MHz 8pF 15ppm 3.2 x 2.5mm Crystal [Digikey: -10-70°C: 644-1049-1-ND -40-125°C: 644-1129-2-ND]-40~85°C cheaper: 644-1175-6-ND 16.0 MHz 10pF 10ppm 3.2 x 2.5mm Crystal [Digikey: 644-1100-1-ND] 27.12 MHz 18pF 30ppm 3.2 x 2.5mm Crystal [Digikey: 887-1424-1-ND] 27.12MHz 10pF 10ppm 3.2 x 2.5mm Crystal [Digikey: 887-1329-1-ND] 4.9 x 1.8mm - MEMs SMT Crystal 32.768 KHz 12.5pF 20ppm 4.9 x 1.8mm Crystal [Digikey: SE2415CT-ND] 8.0 x 3.8mm - Surface Mount Crystal 32.768kHz 12.5pF 20ppm -40°C-85°C [Digikey: 535-9166-2-ND] Cylinder 32.768KHz Cylinder Crystal (2x6mm body) [Ex. Digikey: 300-8341-2-ND]

## Net classes
1 power: width 0.305 mm
2 gnd: width 0.254 mm
3 can: width 0.203 mm
4 canx: width 0.203 mm

## Board
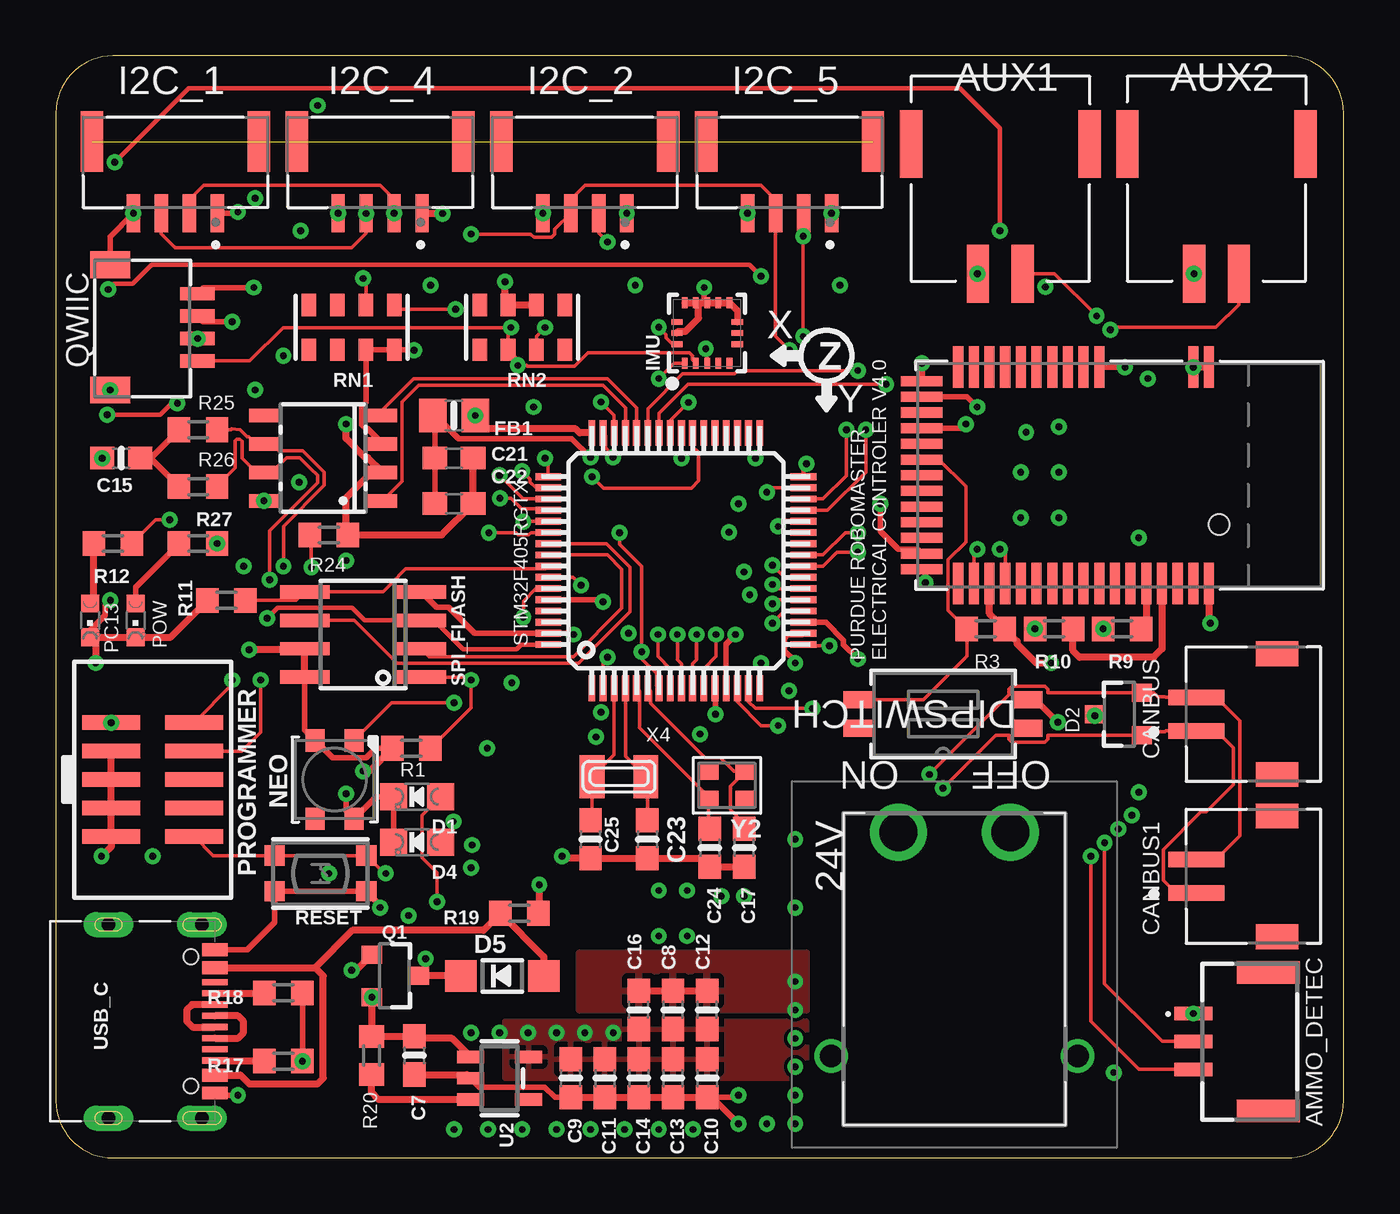
[diagram p2: board, top side]
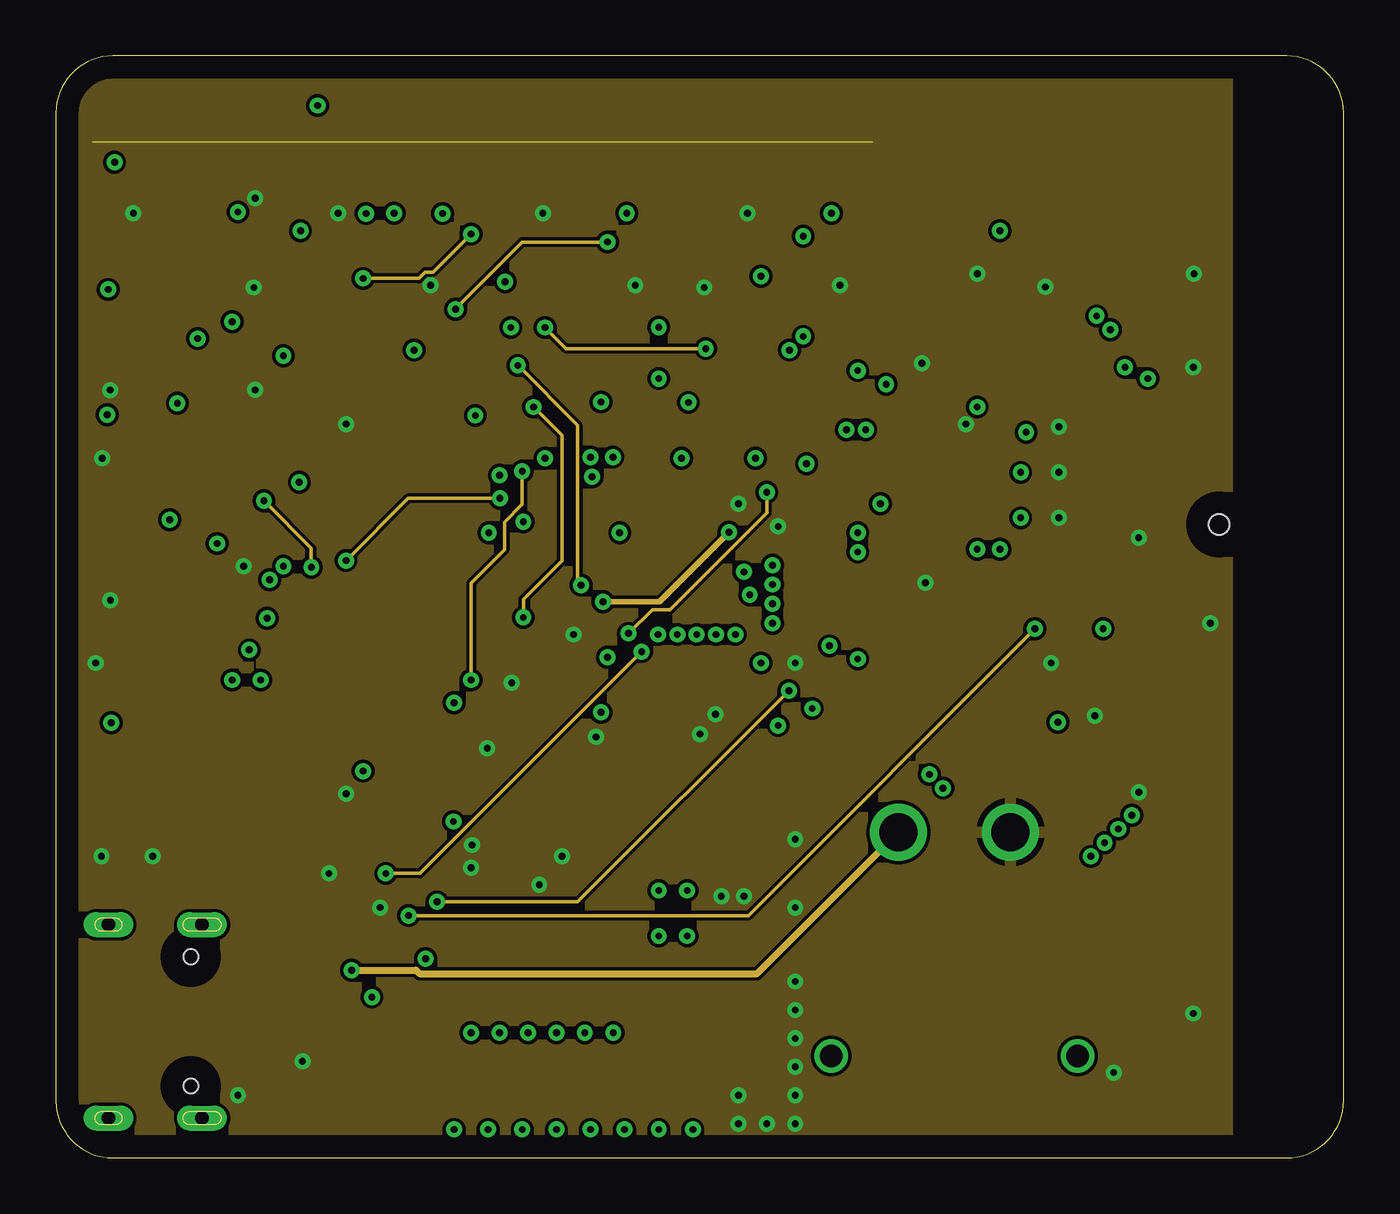
[diagram p3: board, inner layer GND]
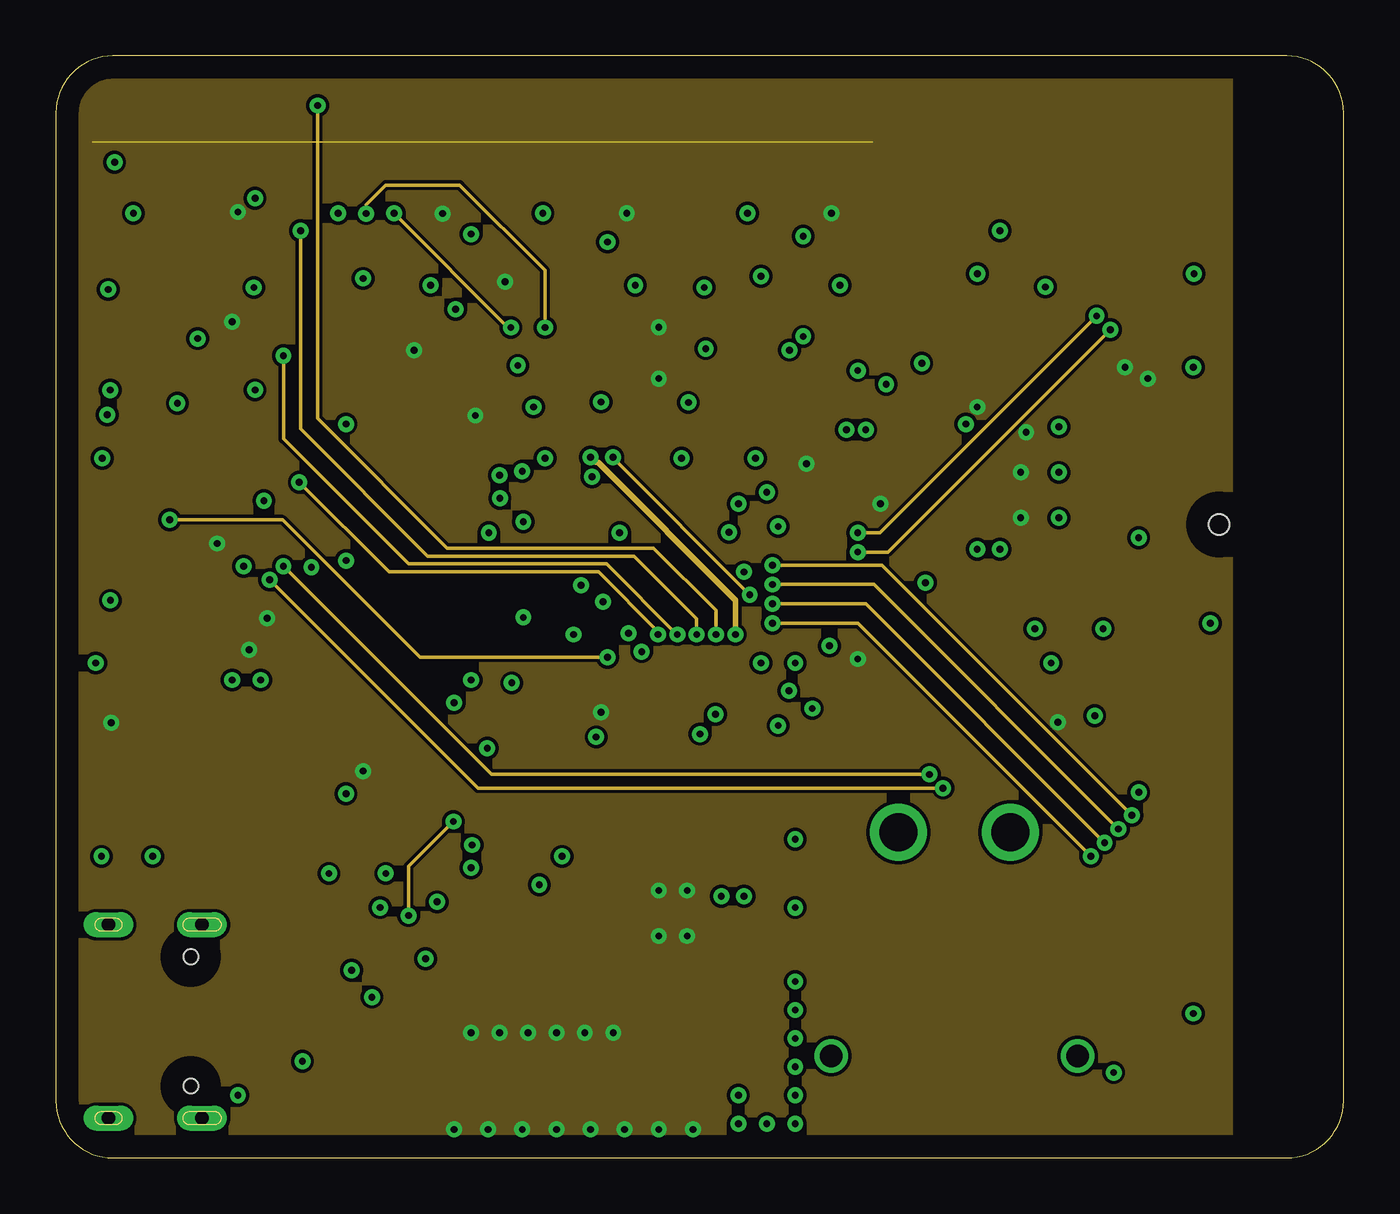
[diagram p4: board, inner layer VCC]
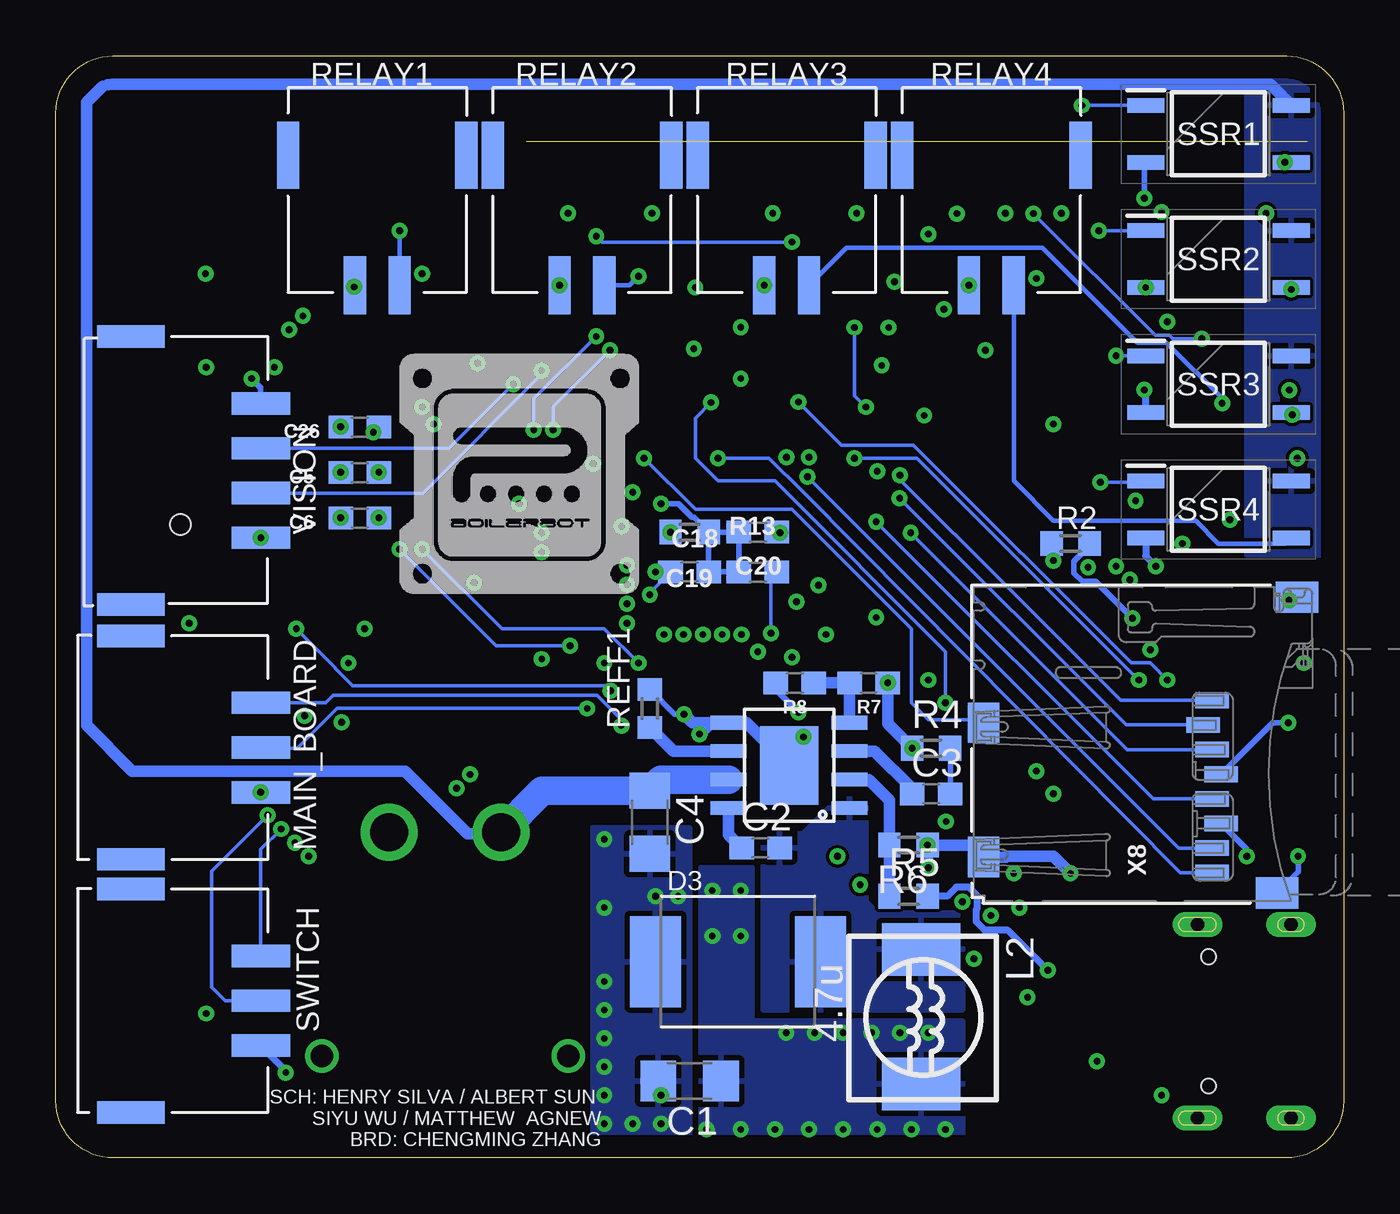
[diagram p5: board, bottom side, seen from below]

Size 57.51 x 49.2 mm. Coordinates in mm from the lower left corner, seen from the top.
Outline: 0,46.66 0,2.54 arc90 2.54,0 54.97,0 arc90 57.51,2.54 57.51,46.66 arc90 54.97,49.2 2.54,49.2 arc90 0,46.66
Copper layers (1+2*15+16): Top 0.035mm / dielectric 1.5mm / GND 0.035mm / dielectric 0.15mm / VCC 0.035mm / dielectric 0.2mm / Bottom 0.035mm
Design rules "default *": minimum track width 6mil, minimum drill 0.3mm, track to track 6mil, track to pad 6mil, pad to pad 6mil, via to via 6mil, smd to smd 6mil, copper to edge 40mil, drill to drill 6mil, minimum pad ring 10mil, minimum via ring 8mil, stop-mask expansion 4mil, vias tented up to drill 15mil, thermal gap 10mil

### Footprints (pad centres in the part's own frame; a part is rotated, then mirrored left to right if it is on the bottom)
XT30PWM = drill 1.7 pad 2.55: 1 -2.5,-5.912; 2 2.5,-5.912 | drill 1 pad 1.5: 3 5.5,4.088; 4 -5.5,4.088
BM03-GHS-TBT = smd 0.6 x 1.7: 1 1.915,5.08; 2 3.165,5.08; 3 4.415,5.08 | smd 1 x 2.8: A 0.065,1.73; B 6.245,1.73
S2B-PH-SM4_TB = smd 1 x 2.6: 1 3.81,8.28; 2 5.81,8.28 | smd 1 x 3: GND 0.826,2.48; GND2 8.787,2.48
C1206 = smd 1.6 x 1.8: 1 -1.4,0; 2 1.4,0
C0603 = smd 1.1 x 1: 1 -0.85,0; 2 0.85,0
0603-NO = smd 1.075 x 1: 1 -0.85,0; 2 0.85,0
SOT96-1 = smd 0.6 x 1.3: 1 -1.905,-2.65; 2 -0.635,-2.65; 3 0.635,-2.65; 4 1.905,-2.65; 5 1.905,2.65; 6 0.635,2.65; 7 -0.635,2.65; 8 -1.905,2.65
JST_S2B-ZR-SM4A-TF(LF)(SN) = smd 0.7 x 2.5: 1 -0.75,2.15; 2 0.75,2.15 | smd 1.1 x 1.9: S1 -2.7,-1.45; S2 2.7,-1.45
CHIPLED_0805_NOOUTLINE = smd 1.2 x 1.2: A 0,-1.05; C 0,1.05
SOT23-3 = smd 0.8 x 0.9: 1 -0.95,-1; 2 0.95,-1; 3 0,1.1
DO-214AB = smd 2.286 x 4.064: 1 -3.683,0; 2 3.683,0
SOD-123 = smd 1.4 x 1.4: A 1.85,0; C -1.85,0
SWSO4_300X100P50B = smd 1.27 x 0.762: 1 -3.81,0.635; 2 -3.81,-0.635; 3 3.81,-0.635; 4 3.81,0.635
0805-NO@1 = smd 1.24 x 1.5: 1 -0.95,0; 2 0.95,0
JST_SM04B-GHS-TB(LF)(SN)- = smd 0.6 x 1.7: 1 -1.875,2.275; 2 -0.625,2.275; 3 0.625,2.275; 4 1.875,2.275 | smd 1 x 2.7: SH1 -3.725,-0.925; SH2 3.725,-0.925
LGA16_3X3MM = smd 0.5 x 0.25: 1 -1.35,1; 2 -1.35,0.5; 3 -1.35,0; 4 -1.35,-0.5; 5 -1.35,-1; 9 1.35,-1; 10 1.35,-0.5; 11 1.35,0; 12 1.35,0.5; 13 1.35,1 | smd 0.25 x 0.5: 6 -0.5,-1.35; 7 0,-1.35; 8 0.5,-1.35; 14 0.5,1.35; 15 0,1.35; 16 -0.5,1.35
MHCI0603-4R7M-R8 = smd 2.35 x 3.5: P$1 0.6,3.23; P$2 6.6,3.23
S3B-PH-SM4_TB = smd 1 x 2.6: 1 3.81,8.28; 2 5.81,8.28; 3 7.81,8.28 | smd 1 x 3: GND 0.826,2.48; GND2 10.794,2.48
LED3535 = smd 1 x 0.85: 1 -1.75,0.875; 2 -1.75,-0.875; 3 1.75,-0.875; 4 1.75,0.875
CHIPLED_0603 = smd 0.8 x 0.8: A 0,-0.75; C 0,0.75
2X05_1.27MM_SMT = smd 0.65 x 2.6: 1 -2.54,-1.85; 2 -2.54,1.85; 3 -1.27,-1.85; 4 -1.27,1.85; 5 0,-1.85; 6 0,1.85; 7 1.27,-1.85; 8 1.27,1.85; 9 2.54,-1.85; 10 2.54,1.85
JST_SH4 = smd 0.6 x 1.55: 1 -1.5,2.514; 2 -0.5,2.514; 3 0.5,2.514; 4 1.5,2.514 | smd 1.2 x 1.8: MT1 -2.8,-1.386; MT2 2.8,-1.386
R0603 = smd 1 x 1.1: 1 -0.85,0; 2 0.85,0
0603 = smd 1.1 x 1: 1 -0.85,0; 2 0.85,0
BTN_KMR2_4.6X2.8 = smd 0.9 x 0.9: A 2.05,0.8; A' -2.05,0.8; B 2.05,-0.8; B' -2.05,-0.8
0805-ARV = smd 0.65 x 1: 1 -1.905,-1; 2 -0.635,-1; 3 0.635,-1; 4 1.905,-1; 5 1.905,1; 6 0.635,1; 7 -0.635,1; 8 -1.905,1
SOIC8_150MIL = smd 0.6 x 2.2: 1 -1.905,-2.6; 2 -0.635,-2.6; 3 0.635,-2.6; 4 1.905,-2.6; 5 1.905,2.6; 6 0.635,2.6; 7 -0.635,2.6; 8 -1.905,2.6
SOP254P700X230-4N = smd 1.65 x 0.65: 1 -3.25,1.27; 2 -3.25,-1.27; 3 3.25,-1.27; 4 3.25,1.27
TQFP64 = smd 1.143 x 0.305: 1 -5.7,3.75; 2 -5.7,3.25; 3 -5.7,2.75; 4 -5.7,2.25; 5 -5.7,1.75; 6 -5.7,1.25; 7 -5.7,0.75; 8 -5.7,0.25; 9 -5.7,-0.25; 10 -5.7,-0.75; 11 -5.7,-1.25; 12 -5.7,-1.75; 13 -5.7,-2.25; 14 -5.7,-2.75; 15 -5.7,-3.25; 16 -5.7,-3.75; 33 5.7,-3.75; 34 5.7,-3.25; 35 5.7,-2.75; 36 5.7,-2.25; 37 5.7,-1.75; 38 5.7,-1.25; 39 5.7,-0.75; 40 5.7,-0.25; 41 5.7,0.25; 42 5.7,0.75; 43 5.7,1.25; 44 5.7,1.75; 45 5.7,2.25; 46 5.7,2.75; 47 5.7,3.25; 48 5.7,3.75 | smd 0.305 x 1.143: 17 -3.75,-5.7; 18 -3.25,-5.7; 19 -2.75,-5.7; 20 -2.25,-5.7; 21 -1.75,-5.7; 22 -1.25,-5.7; 23 -0.75,-5.7; 24 -0.25,-5.7; 25 0.25,-5.7; 26 0.75,-5.7; 27 1.25,-5.7; 28 1.75,-5.7; 29 2.25,-5.7; 30 2.75,-5.7; 31 3.25,-5.7; 32 3.75,-5.7; 49 3.75,5.7; 50 3.25,5.7; 51 2.75,5.7; 52 2.25,5.7; 53 1.75,5.7; 54 1.25,5.7; 55 0.75,5.7; 56 0.25,5.7; 57 -0.25,5.7; 58 -0.75,5.7; 59 -1.25,5.7; 60 -1.75,5.7; 61 -2.25,5.7; 62 -2.75,5.7; 63 -3.25,5.7; 64 -3.75,5.7
BLE_MODULE_RAYTAC_MDBT40 = smd 1.85 x 0.45: 1 -4.825,4; 2 -4.825,3.3; 3 -4.825,-0.9; 4 -4.825,-1.6; 5 -4.825,-2.3; 6 -4.825,-3; 7 -4.825,-3.7; 8 -4.825,-4.4; 9 -4.825,-5.1; 10 -4.825,-5.8; 11 -4.825,-6.5; 12 -4.825,-7.2; 26 4.825,-7.2; 27 4.825,-6.5; 28 4.825,-5.8; 29 4.825,-5.1; 30 4.825,-4.4; 31 4.825,-3.7; 32 4.825,-3; 33 4.825,-2.3; 34 4.825,-1.6; 35 4.825,-0.9; 36 4.825,-0.2; 37 4.825,0.5; 38 4.825,1.2; 39 4.825,1.9; 40 4.825,2.6; 41 4.825,3.3; 42 4.825,4 | smd 0.45 x 1.85: 13 -4.2,-8.825; 14 -3.5,-8.825; 15 -2.8,-8.825; 16 -2.1,-8.825; 17 -1.4,-8.825; 18 -0.7,-8.825; 19 0,-8.825; 20 0.7,-8.825; 21 1.4,-8.825; 22 2.1,-8.825; 23 2.8,-8.825; 24 3.5,-8.825; 25 4.2,-8.825 | hole 0.9: 2.2,4.45
SOT23-5 = smd 0.55 x 1.2: 1 -0.95,-1.3; 2 0,-1.3; 3 0.95,-1.3; 4 0.95,1.3; 5 -0.95,1.3
MP1584_V2 = smd 1.6 x 0.61: BST 2.7,1.905; COMP -2.7,-0.635; EN -2.7,0.635; FB -2.7,-1.905; FREQ 2.7,-0.635; GND 2.7,-1.905; SW -2.7,1.905; VIN 2.7,0.635 | smd 2.62 x 3.51: GND_B 0,0
USB_C_CUSB31-CFM2AX-01-X = smd 0.575 x 1.15: A1B12 -3.2,3.545; A4B9 -2.4,3.545; B1A12 3.2,3.545; B4A9 2.4,3.545 | smd 0.275 x 1.15: A5 -1.25,3.545; A6 -0.25,3.545; A7 0.25,3.545; A8 1.25,3.545; B5 1.75,3.545; B6 0.75,3.545; B7 -0.75,3.545; B8 -1.75,3.545 | drill 0.6 pad 1 long: M1 -4.32,2.97; M2 4.32,2.97; M3 -4.32,-1.21; M4 4.32,-1.21 | hole 0.65: 2.89,2.47; -2.89,2.47
S4B-PH-SM4_TB = smd 1 x 2.6: 1 3.27,7.9; 2 5.27,7.9; 3 7.27,7.9; 4 9.27,7.9 | smd 1 x 3: GND 0.286,2.1; GND2 12.254,2.1
XTAL3215 = smd 1.1 x 1.9: P$1 1.2,0; P$2 -1.2,0
MICROSD = smd 0.7 x 1.5: 1 9,-10.64; 2 7.9,-10.24; 3 6.8,-10.64; 4 5.7,-11.04; 5 4.6,-10.64; 6 3.5,-11.04; 7 2.4,-10.64; 8 1.3,-10.64 | smd 1.8 x 1.4: CD1 2,-0.44; CD2 8,-0.44 | smd 1.4 x 1.9: MT1 0.4,-13.54; MT2 13.6,-14.44
CRYSTAL_2.5X2 = smd 0.9 x 0.75: 1 -0.825,-0.625; 2 0.825,-0.625; 3 0.825,0.625; 4 -0.825,0.625

### Placement (x,y rotation side)
24V  40.13,8.64 180 top
AMMO_DETEC  55.88,2.03 90 top
AUX1  46.99,47.75 180 top
AUX2  56.64,47.75 180 top
C1  29.21,3.43 180 bottom
C2  26.04,13.84 0 bottom
C3  18.41,16.26 0 bottom
C4  30.99,14.99 270 bottom
C5  43.94,30.61 180 bottom
C6  43.94,28.57 180 bottom
C7  16,4.57 270 top
C8  27.56,6.6 90 top
C9  22.99,3.56 270 top
C10  29.08,3.56 270 top
C11  24.51,3.56 270 top
C12  29.08,6.6 90 top
C13  27.56,3.56 270 top
C14  26.04,3.56 270 top
C15  2.92,31.24 180 top
C16  26.04,6.6 90 top
C17  30.73,13.84 270 top
C18  26.16,27.94 180 bottom
C19  26.16,26.16 180 bottom
C20  29.21,26.16 0 bottom
C21  17.78,31.24 0 top
C22  17.78,29.21 0 top
C23  26.42,14.22 270 top
C24  29.21,13.84 270 top
C25  23.88,14.22 270 top
C26  43.94,32.64 180 bottom
CAN_CONVERTER  11.94,31.24 90 top
CANBUS  53.09,19.81 90 top
CANBUS1  53.09,12.57 90 top
D1  16.13,16.13 90 top
D2  47.5,19.81 90 top
D3  27.05,8.76 0 bottom
D4  16.13,14.1 90 top
D5  19.94,8.13 0 top
DIPSWITCH  39.62,19.81 180 top
FB1  17.78,33.15 180 top
I2C_1  5.33,44.45 180 top
I2C_2  23.62,44.45 180 top
I2C_4  14.48,44.45 180 top
I2C_5  32.77,44.45 180 top
IMU  29.08,36.83 90 top
L2  22.1,9.91 270 bottom
MAIN_BOARD  56.64,24.13 270 bottom
NEO  12.45,16.89 270 top
PC13  1.52,24 180 top
POW  3.56,24 180 top
PROGRAMMER  4.32,16.89 270 top
Q1  15.11,8.13 270 top
QWIIC  3.81,37.08 270 top
R1  15.88,18.29 180 top
R2  12.19,27.43 0 bottom
R3  41.53,23.62 180 top
R4  18.41,18.29 0 bottom
R5  19.43,11.68 0 bottom
R6  19.43,13.97 180 bottom
R7  21.21,21.21 180 bottom
R8  24.51,21.21 180 bottom
R9  47.62,23.62 180 top
R10  44.58,23.62 180 top
R11  7.62,24.89 180 top
R12  2.54,27.43 180 top
R13  29.21,27.94 0 bottom
R17  10.16,4.32 180 top
R18  10.16,7.37 180 top
R19  20.7,10.92 180 top
R20  14.1,4.57 90 top
R24  12.19,27.81 180 top
R25  6.35,32.51 0 top
R26  6.35,29.97 0 top
R27  6.35,27.43 180 top
REFF1  30.99,20.07 90 bottom
RELAY1  38.35,47.24 180 bottom
RELAY2  29.21,47.24 180 bottom
RELAY3  20.07,47.24 180 bottom
RELAY4  10.92,47.24 180 bottom
RESET  11.81,12.7 0 top
RN1  13.21,37.08 180 top
RN2  20.83,37.08 0 top
SPI_FLASH  13.72,23.37 90 top
SSR1  5.59,45.72 0 bottom
SSR2  5.59,40.13 0 bottom
SSR3  5.59,34.54 0 bottom
SSR4  5.59,28.96 0 bottom
STM32F405RGTX  27.69,26.67 90 top
SWITCH  56.64,12.83 270 bottom
U1  47.5,30.48 270 top
U2  19.81,3.56 270 top
U$10  24.77,17.53 180 bottom
USB_C  3.56,6.1 270 top
VISION  56.26,36.96 270 bottom
X4  25.15,17.02 180 top
X8  16.51,11.43 90 bottom
Y2  29.97,16.64 180 top

### Tracks (layer width: path | path; a pad name or v marks a point on that pad's centre or on a via)
3.3V  (via drill 0.3)
  Top 0.152: IMU.1 27.61,35.48 v26.92,34.8 | v26.92,37.08 27.25,36.75 27.25,36.61 27.54,36.33 IMU.16
  Top 0.203: STM32F405RGTX.32 33.39,30.85 v33.53,30.99 | STM32F405RGTX.64 20.78,22.92 20.57,22.71 18.18,22.71 16.89,24 SPI_FLASH.3 13.78,24 13.22,24.56 9.91,24.56 v9.45,24.09 v9.44,24.09
  Top 0.254: SPI_FLASH.8 11.12,19.1 NEO.2 12.35,17.86 13.86,17.86 14.29,18.29 R1.2 | DIPSWITCH.2 43.75,20.45 v44.75,19.45 | U1.24 38.48,27.18 37.63,27.18 36.83,27.98 v36.83,29.21 | U1.14 40.7,33.98 v41.15,33.53 | U1.3 v47.75,35.3 v47.75,35.31 | v35.81,22.28 35.18,22.91 35.18,23.12 34.38,23.92 STM32F405RGTX.19 | v16,36.07 15.99,36.08 RN1.8 RN1.7 13.84,33.75 13.66,33.56 13.66,32.73 13.82,32.57 13.9,32.57 CAN_CONVERTER.3 | QWIIC.2 6.57,37.34 v7.87,37.34 | I2C_1.1 8.07,42.17 v8.13,42.23
  Top 0.305: RN2.6 RN2.7 20.07,38.21 v20.07,39.12 | I2C_4.1 17.26,42.17 v17.27,42.16 | STM32F405RGTX.48 23.4,32.37 23.22,32.55 19.33,32.55 FB1.1 | v8.64,22.68 11.06,22.68 SPI_FLASH.7 SPI_FLASH.8 | R1.2 14.01,17.27 v13.72,17.27
  Bottom 0.254: VISION.1 48.36,34.39 v48.77,34.8 | X8.4 3.17,19.43 PROGRAMMER.1 | R2.2 11.34,27.34 12.04,26.64 12.04,26.11 11.67,25.74 11.09,25.74 v9.44,24.09 | R8.2 25.36,20.9 v24.35,19.89
  Bottom 0.305: C26.1 v43.33,32.4
  other vias: 25.5,42.17 34.64,42.17 43.09,30.61 43.09,28.57 18.73,33.15 2.47,19.43 7.2,27.43 17.78,1.27 19.3,1.27 20.83,1.27 22.35,1.27 23.88,1.27 25.4,1.27 26.92,1.27 28.45,1.27 18.54,5.59 19.81,5.59 21.08,5.59 22.35,5.59 23.62,5.59 24.89,5.59 28.19,9.91 26.92,9.91 26.92,11.94 28.19,11.94
  pour VCC: -1.27,49.53 -1.27,0 52.32,0 52.32,49.53
  pour Bottom: 17.02,6.1 26.42,6.1 26.42,12.95 28.7,12.95 28.7,1.02 17.02,1.02
  pour Top: 33.53,3.56 20.07,3.56 20.07,6.1 33.53,6.1
3V3EN
  Bottom 0.508: R5.1 R6.2 20.28,15.96 21.21,16.89 U$10.EN
24V  (via drill 0.3)
  Top 0.305: Q1.1 13.42,8.38 v13.21,8.38
  GND 0.305: v13.21,8.38 16.08,8.38 16.24,8.23 31.31,8.23 24V.2
  Bottom 0.305: v13.21,8.38 14.99,10.16 16.02,10.16 16.41,10.55 16.41,11.09 16.36,11.14 16.36,11.7 16.74,12.09 17.29,12.09 17.7,11.68 R5.2
  Bottom 0.508: SSR1.4 3.28,47.93 54.97,47.93 55.19,47.91 55.41,47.85 55.44,47.84 56.15,47.13 56.15,19.32 54.1,17.27 41.91,17.27 39.12,14.48 37.7,14.48 24V.2
  Bottom 1.27: 24V.2 35.79,16.39 C4.1 30.48,16.89 U$10.VIN
  pour Bottom: 4.32,49.78 4.32,26.92 -0.51,26.92 -0.51,49.78
!RESET  (via drill 0.3)
  Top 0.152: PROGRAMMER.10 7.02,13.5 RESET.A' RESET.A 14.66,12.7 v14.73,12.7 | STM32F405RGTX.7 26.82,21.09 26.82,21.64 26.16,22.29 v26.16,22.61 26.16,26.42 25.18,27.4 v25.18,27.91
  GND 0.152: v26.16,22.61 16.26,12.7 v14.73,12.7
  Bottom 0.152: C18.1 25.28,27.91 v25.18,27.91
AMMO1  (via drill 0.3)
  Top 0.152: STM32F405RGTX.20 32.55,24.42 v32,23.88 | v46.23,13.46 46.23,6.1 48.38,3.95 AMMO_DETEC.1
  VCC 0.152: v32,23.88 35.81,23.88 v46.23,13.46
AMMO2  (via drill 0.3)
  Top 0.152: STM32F405RGTX.21 32.3,24.92 32.12,24.74 v32,24.74 | AMMO_DETEC.2 49.41,5.2 46.84,7.77 v46.84,14.07
  VCC 0.152: v32,24.74 36.17,24.74 v46.84,14.07
BOARD_RX  (via drill 0.3)
  Top 0.152: STM32F405RGTX.15 30.94,20.37 31.24,20.07 v33.78,20.07
  Bottom 0.152: v33.78,20.07 44.96,20.07 46.74,18.29 48.33,18.29 MAIN_BOARD.2
BOARD_TX  (via drill 0.3)
  Top 0.152: STM32F405RGTX.14 30.44,20.36 31.5,19.3 v32.26,19.3
  Bottom 0.152: MAIN_BOARD.1 45.47,20.32 45.14,20.65 33.35,20.65 32.26,19.56 v32.26,19.3
BOOT0  (via drill 0.3)
  Top 0.254: STM32F405RGTX.60 24.36,24.92 v24.44,24.84
  GND 0.254: R13.1 26.96,24.84 v24.44,24.84
  other vias: 30.06,27.94
BST1
  Bottom 0.508: C2.1 27.46,14.42 U$10.BST
CAN_N  (via drill 0.3)
  Top 0.152: CANBUS1.2 51.84,13.32 52.89,14.37 52.89,19.51 51.84,20.56 CANBUS.2 49.56,20.56 49.53,20.59 49.22,20.59 49.05,20.76 D2.2 44.3,20.76 44.3,20.92 44.16,21.06 42.7,21.06 42.57,20.92 42.57,20.68 v39.01,17.12 | v10.16,26.42 10.16,28.19 11.99,30.02 11.99,30.61 11.02,31.58 9.94,31.58 9.64,31.88 CAN_CONVERTER.6 8.94,31.88 8.61,32.2 8.53,32.2 8.23,32.5 7.85,32.55 7.82,32.51 R25.2
  VCC 0.152: v39.01,17.12 19.45,17.12 v10.16,26.42
CAN_P  (via drill 0.3)
  Top 0.152: CANBUS1.1 50.04,11.82 49.46,12.4 49.46,13.77 51.14,15.45 51.38,15.45 52.58,16.66 52.58,18.32 51.84,19.06 CANBUS.1 49.56,19.06 49.53,19.03 49.22,19.03 49.05,18.86 D2.1 44.3,18.86 44.3,18.7 44.16,18.57 42.7,18.57 42.57,18.7 42.57,18.86 41.98,18.86 v39.62,16.51 | v9.54,25.82 9.54,28 11.68,30.15 11.68,30.48 11.36,30.8 | 11.36,30.8 10.89,31.27 10.3,31.27 9.64,30.61 CAN_CONVERTER.7 8.94,30.61 8.31,31.23 8.31,31.99 8.21,32.09 8.07,32.09 8,32.02 8,30.82 7.2,30.02 R26.2 | 11.36,30.8
  VCC 0.152: v39.62,16.51 18.84,16.51 v9.54,25.82
CANRX_N
  Top 0.152: CAN_CONVERTER.4 14.59,33.4 15.98,34.8 24.64,34.8 25.94,33.5 STM32F405RGTX.44
CANTX_P
  Top 0.152: STM32F405RGTX.45 25.44,33.49 24.43,34.49 16.2,34.49 15.47,33.76 15.47,30.21 15.33,30.08 CAN_CONVERTER.1
CC1
  Top 0.305: USB_C.A5 9.29,7.35 R18.2
CC2
  Top 0.305: R17.2 7.13,4.32 USB_C.B5
COMP_3V3
  Bottom 0.508: U$10.COMP 20.95,18.16 19.27,16.47 C3.1
CONNECTED_LED
  Top 0.305: U1.39 49.4,22.73 49.02,22.35 45.72,22.35 45.43,22.64 R10.1
D11  (via drill 0.3)
  Top 0.152: STM32F405RGTX.11 28.94,21.85 29.48,22.39 v29.48,23.37
  VCC 0.152: v29.48,23.37 29.48,24.44 26.69,27.23 17.48,27.23 11.68,33.02 v11.68,46.99
  Bottom 0.152: SSR1.1 v11.68,46.99
D12  (via drill 0.3)
  Top 0.152: STM32F405RGTX.10 28.44,22.05 28.62,22.23 v28.62,23.37
  VCC 0.152: v28.62,23.37 28.62,24.08 25.83,26.87 16.61,26.87 10.92,32.56 v10.92,41.4
  Bottom 0.152: v10.92,41.4 SSR2.1
D13  (via drill 0.3)
  Top 0.152: STM32F405RGTX.9 27.94,22.05 27.75,22.23 v27.75,23.37
  VCC 0.152: v27.75,23.37 27.73,23.37 24.58,26.52 15.74,26.52 10.16,32.1 v10.16,35.81
  Bottom 0.152: v10.16,35.81 SSR3.1
D14  (via drill 0.3)
  Top 0.152: STM32F405RGTX.8 27.44,21.85 26.89,22.39 v26.89,23.37
  VCC 0.152: v26.89,23.37 26.89,23.5 24.22,26.16 14.88,26.16 v10.87,30.17
  Bottom 0.152: v10.87,30.17 8.89,30.17 SSR4.1
D+
  Top 0.305: USB_C.B6 8.14,5.35 8.38,5.59 8.38,6.1 8.13,6.35 USB_C.A6
D-
  Top 0.305: USB_C.B7 6.08,6.85 5.84,6.6 5.84,6.1 6.1,5.84 USB_C.A7
EN
  Top 0.305: U2.3 14.41,2.61 14.1,2.92 R20.1
FB_3V3
  Bottom 0.508: U$10.FB R7.2 R8.1
FLASH_CS  (via drill 0.3)
  Top 0.152: v20.83,30.66 21.19,30.3 21.19,30.17 21.44,29.92 STM32F405RGTX.50 | SPI_FLASH.1 18.41,21.46 v18.54,21.34 18.54,20.11 R1.1
  GND 0.152: v20.83,30.66 20.83,29.18 20.04,28.39 20.04,27.15 18.54,25.65 v18.54,21.34
FLASH_MISO
  Top 0.152: STM32F405RGTX.56 24.64,26.92 25.27,26.29 25.27,24.54 23.11,22.38 16.67,22.38 SPI_FLASH.2
FLASH_MOSI
  Top 0.152: STM32F405RGTX.57 21.87,26.3 15.62,26.3 14.99,25.67 14.99,25.66 14.61,25.27 SPI_FLASH.5 10.73,24.89 R11.1
FLASH_SCK
  Top 0.152: STM32F405RGTX.55 24.59,27.42 25.65,26.37 25.65,24.38 23.34,22.08 15.24,22.08 13.31,24 SPI_FLASH.6
FREQ1
  Bottom 0.508: REFF1.1 29.93,18.16 U$10.FREQ
GND  (via drill 0.3)
  Top 0.254: STM32F405RGTX.12 29.46,20.94 v29.46,19.81 | v23.11,23.37 23.06,23.42 STM32F405RGTX.63 18.69,23.42 17.53,24.58 17.01,24.58 SPI_FLASH.4 | D4.C D1.C 14.31,16.13 NEO.4 12.95,15.51 v12.95,16.26 | v14.48,11.18 14.48,11.28 RESET.B RESET.B' 9.76,10.52 8.53,9.3 USB_C.A1B12 | R18.1 R17.1 | USB_C.B1A12 7.2,2.79 v8.13,2.79 | U1.25 38.83,26.12 v38.83,25.69 | U1.16 40.45,32.58 v40.64,32.77 | STM32F405RGTX.28 32.48,28.42 v32.26,28.19 | STM32F405RGTX.18 33.32,23.35 32.7,23.35 32.53,23.19 32.53,22.65 33.02,22.17 v33.02,22.1 | IMU.11 28.96,38.31 v28.96,38.86 | QWIIC.1 6.6,38.86 SSR2.2 | v2.43,24.89 2.2,24.66 2.2,24.24 1.52,23.56 PC13.C | U2.2 18.91,3.16 21.83,3.16 22.28,2.71 C9.2 | v30.48,2.79 30.39,2.71 C10.2 29.3,2.71 v30.48,1.52 | QWIIC.MT1 2.42,41.14 v3.46,42.17
  Top 0.305: C7.2 18.35,3.72 U2.2 | C9.2 C11.2 C14.2 C13.2 C10.2 | PROGRAMMER.3 PROGRAMMER.5 PROGRAMMER.7 PROGRAMMER.9 2.47,13.9 v2.03,13.46 | R11.2 5.13,23.25 POW.C PC13.C 1.78,23 v1.78,22.1 | v12.95,32.77 12.95,32.13 13.81,31.27 13.92,31.27 CAN_CONVERTER.2 14.1,30.61 12.95,29.46 12.95,27.9 R24.1 17.23,27.81 C22.2 C21.2 | IMU.13 IMU.12 28.7,38.18 | 28.7,38.18 IMU.11 IMU.10 IMU.9 30.43,37.83 IMU.8 | IMU.15 27.8,36.9 28.11,36.9 28.7,37.49 28.7,38.18 | U1.13 v38.67,35.48 | AUX1.2 v41.16,39.47 | D2.3 v46.4,19.74 | U1.28 41.7,24.3 R3.1 42.92,23.08 42.92,22.95 43.77,22.1 v44.45,22.1 | U1.42 51.5,23.94 v51.56,23.88 | U1.1 U1.2 | R19.1 21.59,10.96 v21.59,12.19 | C17.2 C24.2 28.83,13.37 C23.2 C25.2 22.69,13.37 v22.61,13.46 | C16.2 C8.2 C12.2
  Bottom 0.254: C18.2 27.18,27.94 | 27.18,27.94 R13.2 | 27.18,27.94 27.01,27.77 C19.2 C20.2 R13.2 | R13.2 29.02,28.6 29.1,28.6 29.71,29.21 v30.48,29.21 | SSR1.2 8.89,44.4 v8.89,42.85 | REFF1.2 29.88,19.81 v29.46,19.81 | X8.MT2 2.29,25.03 v2.43,24.89 | X8.MT1 2.03,12.77 v2.03,13.46 | X8.6 4.32,13.78 v4.32,13.46
  Bottom 0.305: SSR3.2 8.84,34.24 v8.89,34.29 | SSR4.2 8.84,26.87 v8.38,26.42 | SWITCH.3 47.24,3.9 v47.24,3.81 | RELAY1.2 44.16,38.91 v44.19,38.89
  Bottom 0.508: R4.1 20.36,19.38 R7.1 | v18.54,12.95 18.58,12.99 R6.1 16.61,13.97 X8.CD1 15.08,13.43 15.05,13.46 12.95,13.46 v12.19,12.7 | U$10.GND_B 26.67,19.43 U$10.GND | v29.46,19.81 29.08,19.43 U$10.GND | U$10.GND 28.25,19.43 v28.76,18.92
  other vias: 11.01,4.32 25.88,38.96 16.73,38.96 8.84,38.86 50.8,6.45 48.36,16.32 48.36,27.69 44.79,28.57 44.79,32.64 44.79,30.61 50.8,35.3 50.83,39.47 35.02,38.96 30.89,42.17 21.75,42.17 12.6,42.17 20.36,21.21 19.27,18.29 18.58,13.97 24.13,18.8 2.07,31.24 33.02,1.52 31.75,1.52 33.02,2.79 33.02,4.06 33.02,5.33 33.02,6.6 33.02,7.87 33.02,11.18 33.02,14.22 30.73,11.68 29.72,11.68 2.42,34.28
  pour GND: -1.27,49.53 -1.27,-1.27 52.32,-1.27 52.32,49.53
  pour Bottom: 29.21,14.73 33.53,14.73 33.53,1.02 29.21,1.02
  pour Top: 23.37,9.14 23.37,6.6 33.53,6.6 33.53,9.14
GPIO_AUX1  (via drill 0.3)
  Top 0.152: v35.81,27.91 35.26,27.91 34.26,26.92 STM32F405RGTX.25 | AUX1.1 44.6,39.47 v46.48,37.59
  VCC 0.152: v35.81,27.91 36.8,27.91 v46.48,37.59
GPIO_AUX2  (via drill 0.3)
  Top 0.152: STM32F405RGTX.24 34.26,26.42 34.89,27.05 v35.81,27.05 | v47.09,36.98 47.2,37.08 51.82,37.08 52.83,38.1 AUX2.1
  VCC 0.152: v35.81,27.05 37.16,27.05 v47.09,36.98
I2C-1_CL  (via drill 0.3)
  Top 0.152: I2C_1.2 5.96,42.79 6.6,43.43 14.48,43.43 15.1,42.81 v15.1,42.17 | STM32F405RGTX.58 23.1,25.92 v23.45,25.57 | QWIIC.4 8.66,35.58 10.15,37.08 v20.32,37.08 20.19,36.95 RN2.2 20.63,35.65 v20.63,35.38 21.02,35.38 21.04,35.35 23.15,35.35 23.76,35.96 28.3,35.96 28.44,35.83 28.44,35.63 IMU.2
  GND 0.152: v23.45,25.57 23.29,25.73 23.29,32.72 v20.63,35.38
  VCC 0.152: v15.1,42.17 20.2,37.08 v20.32,37.08
I2C-1_DA  (via drill 0.3)
  Top 0.152: I2C_1.3 4.71,41.27 5.33,40.64 13.21,40.64 13.85,41.28 v13.85,42.16 I2C_4.3 | STM32F405RGTX.59 21.98,25.43 21.45,25.43 20.88,24.86 v20.88,24.13 | RN2.3 21.46,36.7 v21.84,37.08 | IMU.3 29.08,36.07 v29.02,36.13
  GND 0.152: v20.88,24.13 20.88,24.94 22.61,26.67 22.61,32.26 v21.34,33.53 | v29.02,36.13 22.79,36.13 v21.84,37.08
  VCC 0.152: v21.84,37.08 21.84,39.62 18.03,43.43 14.73,43.43 13.85,42.55 v13.85,42.16
  Bottom 0.152: v21.84,37.08 21.84,34.04 v21.34,33.53 | v13.85,42.16 8.41,36.72 7.77,36.72 7.63,36.58 QWIIC.3
  other vias: 6.32,36.58
I2C-2_CL  (via drill 0.3)
  Top 0.152: STM32F405RGTX.29 34.47,28.92 36.17,30.62 v36.17,32.51 | v33.38,36.68 v33.38,41.15 33.39,41.16 I2C_5.2 | I2C_2.2 24.25,41.28 v24.64,40.89 | v17.85,37.89 15.31,37.89 RN1.1
  GND 0.152: v24.64,40.89 20.83,40.89 17.85,37.92 v17.85,37.89
  Bottom 0.152: v36.17,32.51 36.17,33.89 v33.38,36.68 | v24.64,40.89 33.12,40.89 v33.38,41.15
I2C-2_DA  (via drill 0.3)
  Top 0.152: STM32F405RGTX.30 34.26,29.42 35.31,30.46 v35.31,32.51 | v32.77,36.07 32.14,36.69 I2C_5.3 32.14,42.79 31.5,43.43 23.62,43.43 23,42.81 I2C_2.3 22.28,41.45 22.28,41.23 22.14,41.1 21.35,41.1 21.2,41.25 v18.54,41.25 | RN1.2 13.84,39.15 v13.72,39.27
  GND 0.152: v18.54,41.25 16.84,39.55 16.49,39.55 16.21,39.27 v13.72,39.27
  Bottom 0.152: v35.31,32.51 35.31,33.53 v32.77,36.07
MODE_3V
  Top 0.152: DIPSWITCH.3 38.73,20.45 40.68,22.39 R3.2 39.84,24.46 39.84,26.7 40.64,27.5 40.64,29.99 39.45,31.18 U1.18
MODE_LED
  Top 0.305: U1.38 48.7,23.84 R9.1
N$3
  Bottom 0.254: C3.2 R4.2
N$5  (via drill 0.3)
  Top 0.152: v17.02,11.43 17.02,12.73 16.35,13.4 16.35,15.3 D1.A
  GND 0.152: v32.73,20.86 23.3,11.43 v17.02,11.43
  Bottom 0.152: R9.2 45.03,21.88 45.03,21.86 44.26,21.08 32.96,21.08 v32.73,20.86
  other vias: 46.77,23.62
N$6  (via drill 0.3)
  Top 0.152: D4.A 17.75,14.67 v17.75,15.02
  GND 0.152: R10.2 30.93,10.82 v15.75,10.82
  VCC 0.152: v15.75,10.82 15.75,13.02 v17.75,15.02
  other vias: 43.73,23.62
N$9
  Top 0.152: STM32F405RGTX.3 24.94,18.01 X4.P$1 23.95,15.14 C25.1
N$10
  Top 0.152: STM32F405RGTX.4 25.44,17.93 X4.P$2 26.42,16.95 C23.1
N$11
  Top 0.152: STM32F405RGTX.5 26.05,20.85 26.05,19.21 29.15,16.11 Y2.3 29.15,14.76 C24.1
N$12
  Top 0.152: STM32F405RGTX.6 26.55,20.85 26.55,20.3 28.99,17.87 29.69,17.87 30.3,17.26 Y2.1 30.12,16.58 30.12,15.54 30.73,14.93 C17.1
N$13
  Top 0.305: PC13.A 1.69,24.92 R12.2
N$20  (via drill 0.3)
  Top 0.254: C22.1 C21.1 16.93,33.05 FB1.2 16.96,33.15 17.99,32.12 23.04,32.12 v23.88,31.28 | STM32F405RGTX.13 29.94,22.93 30.12,23.11 30.12,23.14 v30.34,23.37
  VCC 0.254: v23.88,31.28 24.11,31.05 24.2,31.05 30.34,24.91 v30.34,23.37
N$21  (via drill 0.3)
  Top 0.152: R24.2 11.41,27.75 v11.41,26.37
  GND 0.152: CAN_CONVERTER.8 11.41,27.22 v11.41,26.37
  other vias: 9.29,29.34
N$22
  Top 0.254: R25.1 4.23,31.24 | C15.1 4.23,31.24 | 4.23,31.24 R26.1
N$23
  Top 0.254: POW.A 3.56,25.49 R27.2
N$32  (via drill 0.3)
  Top 0.305: D5.C Q1.3 16.51,8.43 v16.51,8.89
NEOPIX  (via drill 0.3)
  Top 0.152: STM32F405RGTX.41 27.44,32.92 v28.25,33.73 | NEO.1 15,20.32 v17.78,20.32
  Bottom 0.152: v28.25,33.73 28.96,33.02 28.96,31.24 27.94,30.23 25.4,30.23 17.78,22.61 v17.78,20.32
PC13  (via drill 0.3)
  Top 0.152: STM32F405RGTX.2 24.44,22.15 v24.64,22.35 | R12.1 4.45,28.49 v5.08,28.49
  VCC 0.152: v24.64,22.35 16.26,22.35 10.12,28.49 v5.08,28.49
RELAY1  (via drill 0.3)
  Top 0.203: v42.16,41.4 42.16,45.97 40.39,47.75 5.92,47.75 v2.62,44.45
  Bottom 0.203: SSR1.3 v2.62,44.45 | RELAY1.1 v42.16,41.4
RELAY2  (via drill 0.3)
  Top 0.203: v2.34,38.78 2.59,39.03 3.43,39.03 4.28,39.88 30.99,39.88 v31.5,39.37
  Bottom 0.203: RELAY2.1 31.9,38.96 v31.5,39.37
  Bottom 0.254: SSR2.3 v2.34,38.78
RELAY3  (via drill 0.3)
  Top 0.203: v5.42,33.69 5.17,33.69 4.65,33.18 v2.29,33.18
  Bottom 0.203: RELAY3.1 22.2,40.64 13.46,40.64 9.21,36.39 7.91,36.39 5.42,33.91 v5.42,33.69 | SSR3.3 2.34,33.23 v2.29,33.18
RELAY4
  Bottom 0.203: RELAY4.1 14.73,30.23 12.95,28.45 6.6,28.45 5.59,27.43 2.59,27.43 SSR4.3
RX_BT  (via drill 0.3)
  Top 0.152: U1.29 42.4,26.94 v42.16,27.18 | v34.54,22.86 33.45,22.86 STM32F405RGTX.17
  Bottom 0.152: v42.16,27.18 37.85,22.86 v34.54,22.86
SD_DETECT  (via drill 0.3)
  Top 0.152: STM32F405RGTX.33 31.44,31.44 v31.24,31.24
  Bottom 0.152: v31.24,31.24 28.96,28.96 24.64,28.96 19.3,23.62 19.3,20.32 18.54,19.56 16.2,19.56 X8.CD2
SDIO_CLK  (via drill 0.3)
  Top 0.152: STM32F405RGTX.53 20.89,28.42 v20.88,28.4
  Bottom 0.152: X8.5 8.51,16.03 v20.88,28.4
SDIO_CMD  (via drill 0.3)
  Top 0.152: STM32F405RGTX.54 21.22,27.92 21.12,27.82 20.63,27.82 20.54,27.91 v19.34,27.91
  Bottom 0.152: X8.3 9.66,18.23 v19.34,27.91
SDIO_D0  (via drill 0.3)
  Top 0.152: STM32F405RGTX.39 28.44,31.76 28.7,31.5 28.7,30.23 28.39,29.91 24.45,29.91 v23.94,30.42
  Bottom 0.152: X8.7 7.35,13.83 v23.94,30.42
SDIO_D1  (via drill 0.3)
  Top 0.152: v27.94,31.24 v27.94,31.25 STM32F405RGTX.40
  Bottom 0.152: X8.8 7.3,12.73 24.13,29.72 25.65,31.24 25.81,31.24 v27.94,31.24
SDIO_D2  (via drill 0.3)
  Top 0.152: STM32F405RGTX.51 20.87,29.42 v19.81,30.48
  Bottom 0.152: v19.81,30.48 19.81,30.29 14.96,25.43 9.95,20.43 X8.1
SDIO_D3  (via drill 0.3)
  Top 0.152: v19.83,29.45 20.34,29.45 20.8,28.98 21.92,28.98 STM32F405RGTX.52
  GND 0.152: v19.83,29.45 15.73,29.45 v12.95,26.67
  Bottom 0.152: X8.2 9.71,19.33 v19.83,29.45 | R2.1 13.04,26.76 v12.95,26.67
SHIELD  (7 unrouted)
SW1
  pour Bottom: 17.02,10.92 20.83,10.92 21.34,11.43 21.34,11.68 21.34,16 22.86,16 22.86,15.75 24.13,14.48 25.91,14.48 25.91,6.6 17.02,6.6
SWCLK  (via drill 0.3)
  Top 0.152: PROGRAMMER.4 8.3,18.16 9.14,19.01 v9.14,21.34 | v21.84,31.24 21.99,31.1 STM32F405RGTX.49
  Bottom 0.152: v9.14,21.34 19.05,31.24 v21.84,31.24
SWDIO  (via drill 0.3)
  Top 0.152: PROGRAMMER.2 7.87,21.14 v7.87,21.34 | v24.35,33.75 24.94,33.17 STM32F405RGTX.46
  Bottom 0.152: v7.87,21.34 8.64,22.1 9.47,22.1 19.2,31.83 22.43,31.83 v24.35,33.75
SWITCH1  (via drill 0.3)
  Top 0.152: STM32F405RGTX.22 32.3,25.42 32.12,25.6 v32,25.6
  VCC 0.152: v32,25.6 36.53,25.6 v47.45,14.68
  Bottom 0.152: v47.45,14.68 48.36,13.77 SWITCH.1
SWITCH2  (via drill 0.3)
  Top 0.152: STM32F405RGTX.23 32.55,25.92 v32,26.46
  VCC 0.152: v32,26.46 36.89,26.46 v48.06,15.29
  Bottom 0.152: v48.06,15.29 50.55,12.81 50.55,7.62 49.94,7.02 SWITCH.2
TX_BT  (via drill 0.3)
  Top 0.152: U1.27 41,27.03 v41.15,27.18 | STM32F405RGTX.16 31.44,22.04 v31.5,22.1
  Bottom 0.152: v41.15,27.18 37.59,23.62 33.02,23.62 v31.5,22.1
VBUS
  Top 0.305: USB_C.A4B9 11.57,8.5 | 11.57,8.5 11.94,8.13 11.94,3.56 11.68,3.3 8.64,3.3 8.24,3.7 USB_C.B4A9 | 11.57,8.5 13.23,10.16 19.09,10.16 R19.2 21.79,8.98 D5.A
VCAP1  (via drill 0.3)
  Top 0.152: STM32F405RGTX.31 31.95,29.92 v31.75,29.72
  GND 0.152: v25.58,23.42 26.64,24.48 27.43,24.48 31.75,28.8 v31.75,29.72
  Bottom 0.152: C19.1 25.58,25.9 v25.58,23.42
VCAP2  (via drill 0.3)
  Top 0.152: STM32F405RGTX.47 24.55,32.25 24.55,31.7 24.88,31.38 v24.88,31.29
  VCC 0.152: v30.99,25.15 24.88,31.26 v24.88,31.29
  Bottom 0.152: v30.73,26.16 C20.1 30.99,25.23 v30.99,25.15
VHI  (via drill 0.3)
  Top 0.305: Q1.2 14.1,7.16 R20.2 C7.1 16.09,5.33 17.68,5.33 U2.1
  other vias: 14.11,7.18
VISION_RX  (via drill 0.3)
  Top 0.152: STM32F405RGTX.43 26.44,33.45 27.98,35 30.3,35 30.45,35.15 v35.81,35.15
  Bottom 0.152: VISION.3 41.12,29.69 35.81,34.99 v35.81,35.15
VISION_TX  (via drill 0.3)
  Top 0.152: STM32F405RGTX.42 26.94,33.25 28.23,34.54 v37.08,34.54
  Bottom 0.152: VISION.2 39.94,31.69 v37.08,34.54

### Text on the board
tPlace: X | Z | Y
tNames: PURDUE ROBOMASTER / ELECTRICAL CONTROLER V4.0
bNames: SCH: HENRY SILVA / ALBERT SUN / SIYU WU / MATTHEW AGNEW / BRD: CHENGMING ZHANG